# Altium project MR26_GSS.PrjPcb (part 2 of 2)

## Sheet MR26_GSS_5.SchDoc
size 385 x 297 mm; Origin: Eagle; OriginPath: C:\Users\David Nguyen\Downloads\eagle\eagle\MR26_GSS.sch; OriginSheet: 6; OriginDescription: 07 FPGA I/O, camera FPC & IR illumination
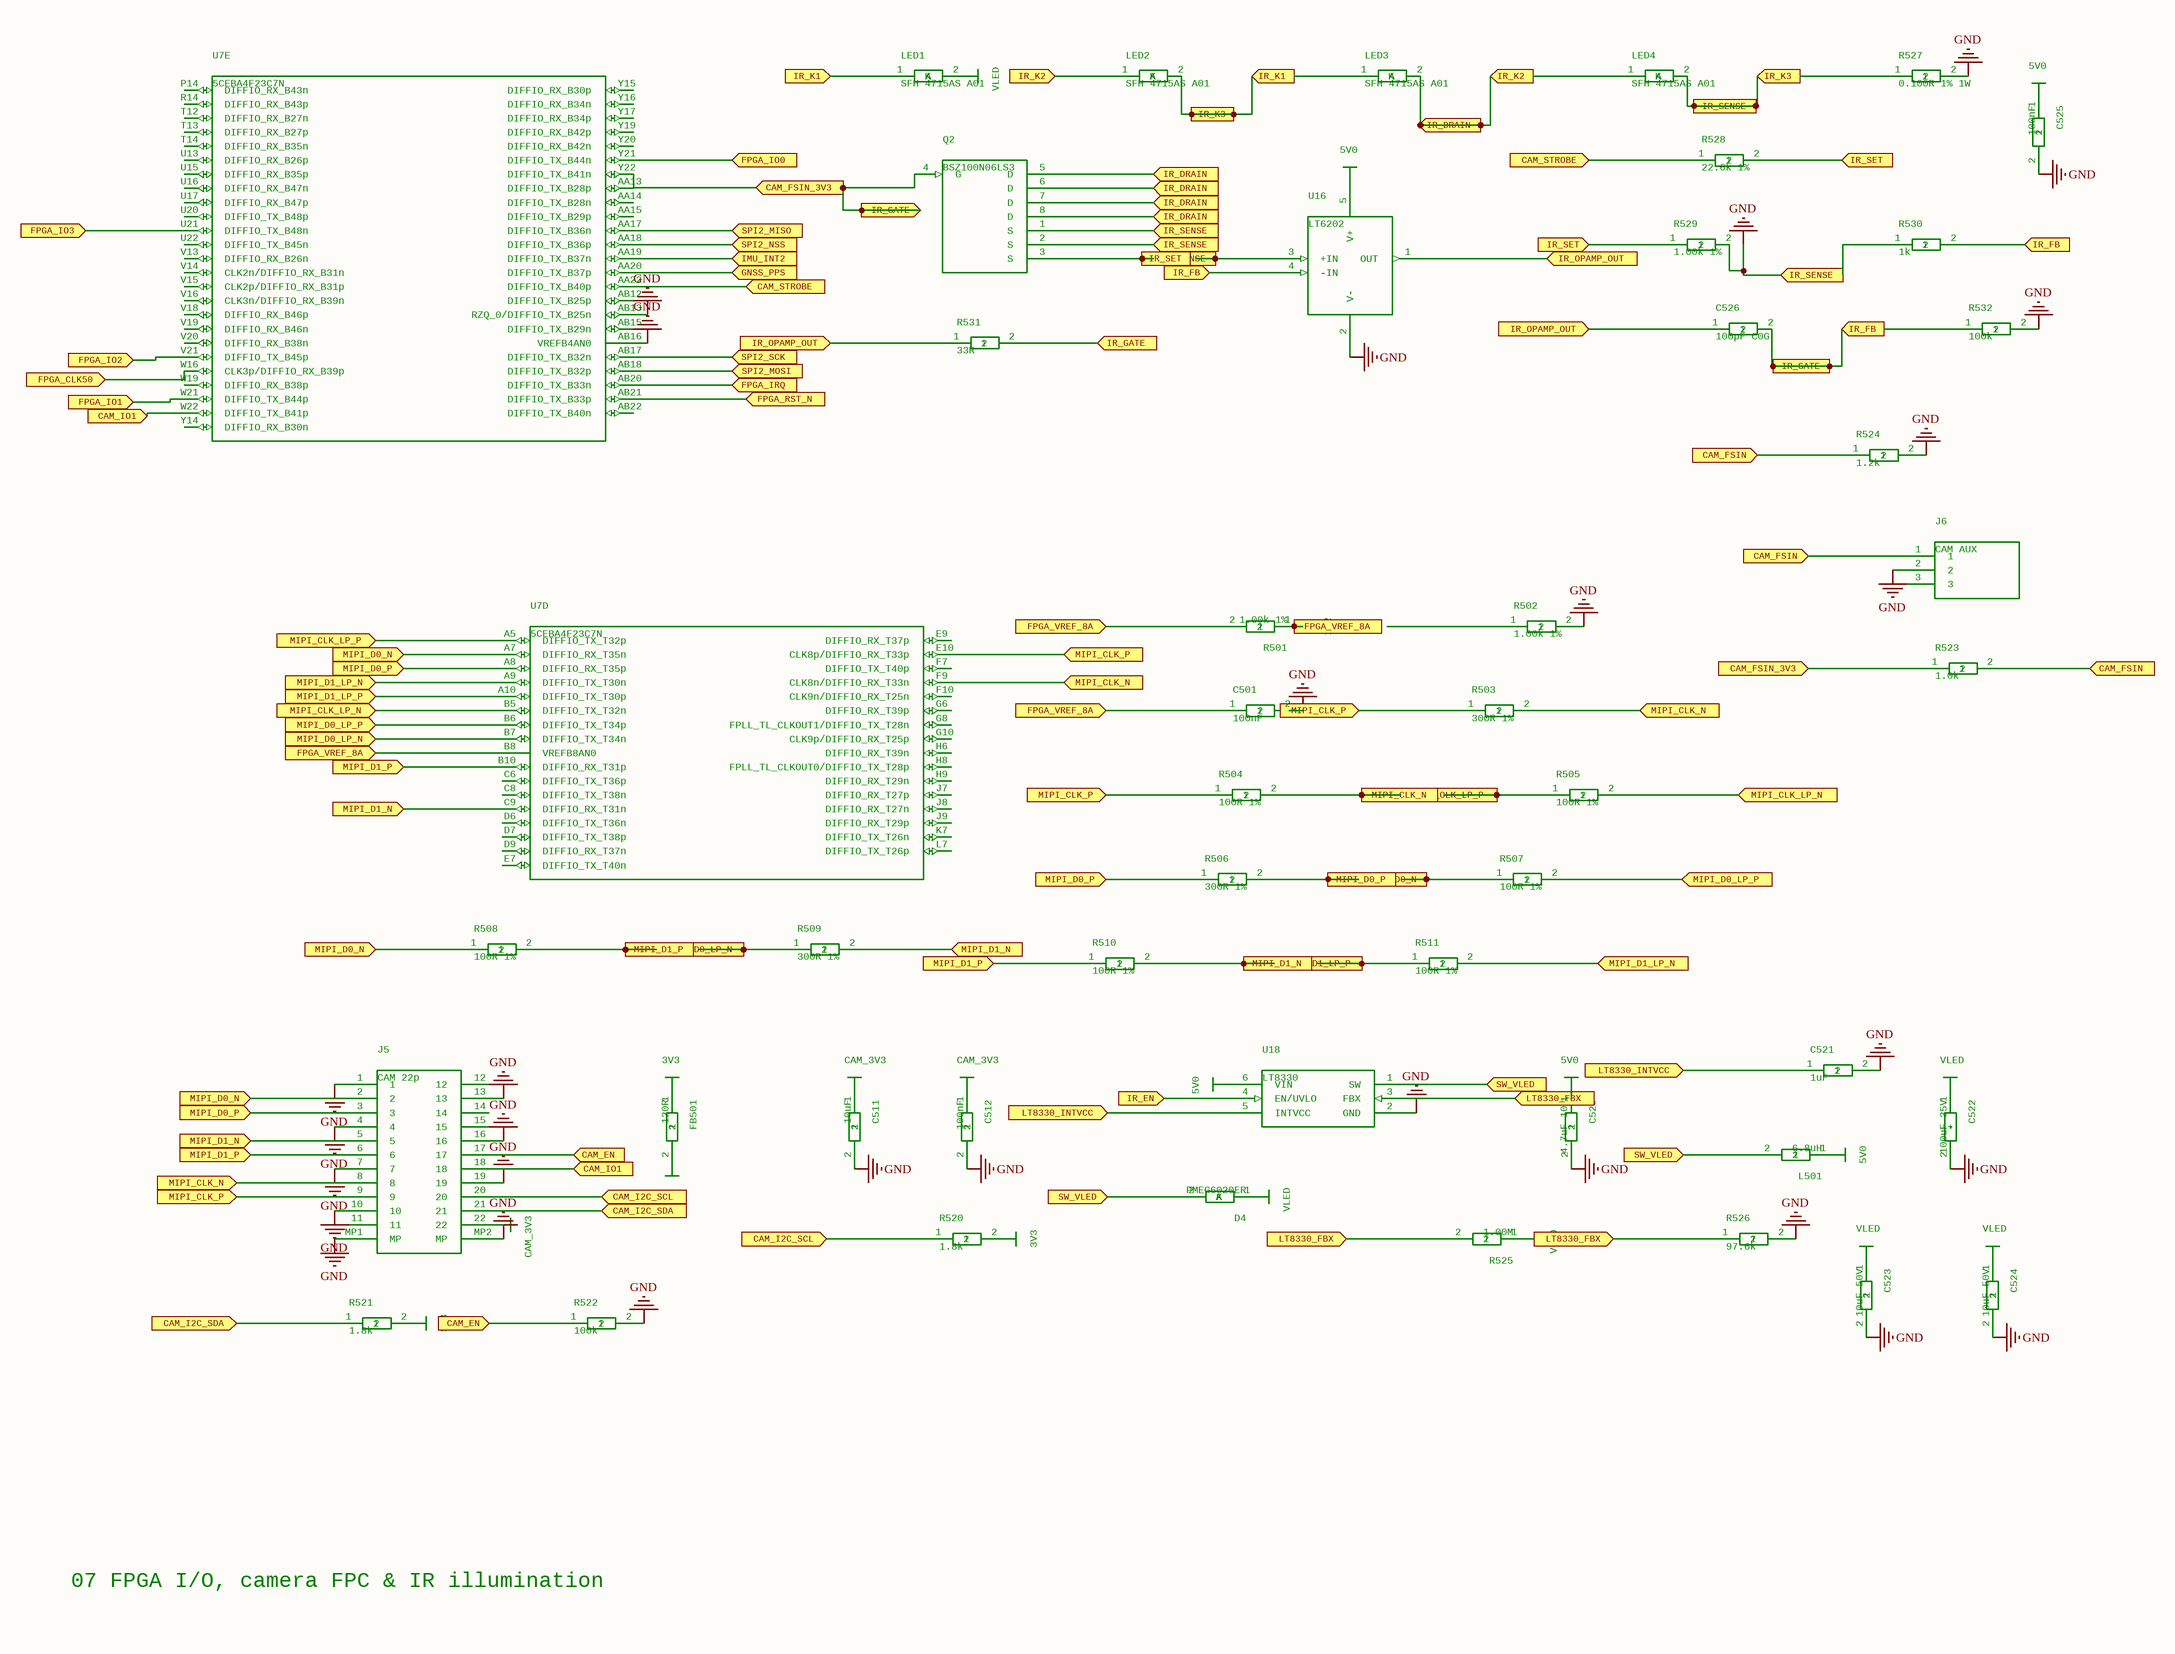
[diagram p5: MR26_GSS_5.SchDoc]

### Parts
C501  100nF  [C_0402]
C511  10uF  [C_0603]
C512  100nF  [C_0402]
C520  4.7uF 10V  [C_0603]
C521  1uF  [C_0402]
C522  100uF 35V  [C_CP_Elec_6.3x7.7]
C523  10uF 50V  [C_1210]
C524  10uF 50V  [C_1210]
C525  100nF  [C_0402]
C526  100pF C0G  [C_0402]
D4  PMEG6020ER  [D_SOD-123W]
FB501  120R  [L_0603]
J5  CAM 22p  [FH12-22S-0.5SH]
J6  CAM AUX  [PinHeader_1x03_P2.54mm]
L501  6.8uH  [L_XEL4030]
LED1  SFH 4715AS A01  [OSLON_Black_3.75x3.75]
LED2  SFH 4715AS A01  [OSLON_Black_3.75x3.75]
LED3  SFH 4715AS A01  [OSLON_Black_3.75x3.75]
LED4  SFH 4715AS A01  [OSLON_Black_3.75x3.75]
PWR0443  1V2
PWR0456  CAM_3V3
PWR0458  3V3
PWR0459  CAM_3V3
PWR0460  CAM_3V3
PWR0462  CAM_3V3
PWR0464  3V3
PWR0465  3V3
PWR0469  5V0
PWR0471  5V0
PWR0474  5V0
PWR0475  VLED
PWR0476  VLED
PWR0478  VLED
PWR0480  VLED
PWR0482  VLED
PWR0484  VLED
PWR0486  5V0
PWR0488  5V0
Q2  BSZ100N06LS3  [PG-TSDSON-8]
R501  1.00k 1%  [R_0402]
R502  1.00k 1%  [R_0402]
R503  300R 1%  [R_0402]
R504  100R 1%  [R_0402]
R505  100R 1%  [R_0402]
R506  300R 1%  [R_0402]
R507  100R 1%  [R_0402]
R508  100R 1%  [R_0402]
R509  300R 1%  [R_0402]
R510  100R 1%  [R_0402]
R511  100R 1%  [R_0402]
R520  1.8k  [R_0402]
R521  1.8k  [R_0402]
R522  100k  [R_0402]
R523  1.0k  [R_0402]
R524  1.2k  [R_0402]
R525  1.00M  [R_0402]
R526  97.6k  [R_0402]
R527  0.100R 1% 1W  [R_1206]
R528  22.6k 1%  [R_0402]
R529  1.00k 1%  [R_0402]
R530  1k  [R_0402]
R531  33R  [R_0402]
R532  100k  [R_0402]
U7  5CEBA4F23C7N  [FBGA-484_23x23_1.0mm]  (parts D,E of 12)
U16  LT6202  [TSOT-23-5]
U18  LT8330  [TSOT-23-6]

### Ports
CAM_EN (in), CAM_FSIN (in), CAM_FSIN_3V3 (in), CAM_I2C_SCL (in), CAM_I2C_SDA (in), CAM_IO1 (in), CAM_STROBE (in), FPGA_CLK50 (in), FPGA_IO0 (in), FPGA_IO1 (in), FPGA_IO2 (in), FPGA_IO3 (in), FPGA_IRQ (in), FPGA_RST_N (in), FPGA_VREF_8A (in), GNSS_PPS (in), IMU_INT2 (in), IR_DRAIN (in), IR_EN (in), IR_FB (in), IR_GATE (in), IR_K1 (in), IR_K2 (in), IR_K3 (in), IR_OPAMP_OUT (in), IR_SENSE (in), IR_SET (in), LT8330_FBX (in), LT8330_INTVCC (in), MIPI_CLK_LP_N (in), MIPI_CLK_LP_P (in), MIPI_CLK_N (in), MIPI_CLK_P (in), MIPI_D0_LP_N (in), MIPI_D0_LP_P (in), MIPI_D0_N (in), MIPI_D0_P (in), MIPI_D1_LP_N (in), MIPI_D1_LP_P (in), MIPI_D1_N (in), MIPI_D1_P (in), SPI2_MISO (in), SPI2_MOSI (in), SPI2_NSS (in), SPI2_SCK (in), SW_VLED (in)

### Nets
GND: C501.2 C511.2 C512.2 C520.2 C521.2 C522.2(-) C523.2 C524.2 C525.2 J5.1 J5.4 J5.7 J5.10 J5.13 J5.16 J5.19 J5.MP1(MP) J5.MP2(MP) J6.2 LED1.1(K) LED2.2(A) LED3.1(K) LED4.2(A) Q2.1(S) Q2.2(S) Q2.3(S) R502.2 R522.2 R524.2 R526.2 R527.1 R527.2 R528.2 R529.1 R529.2 R530.1 R532.2 U7.AB13(RZQ_0/DIFFIO_TX_B25n) U7.AB16(VREFB4AN0) U16.2(V-) U16.3(+IN) U18.2(GND) ; port IR_K1, port IR_K3, port IR_SENSE, port IR_SET
NetC501_1: C501.1 PWR0443.?1(1V2) R501.1 R501.2 U7.B8(VREFB8AN0) ; port FPGA_VREF_8A
NetC511_1: C511.1 PWR0460.?1(CAM_3V3)
NetC512_1: C512.1 PWR0462.?1(CAM_3V3)
NetC520_1: C520.1 PWR0471.?1(5V0)
NetC521_1: C521.1 U18.5(INTVCC) ; port LT8330_INTVCC
NetC522_1: C522.1(+) PWR0478.?1(VLED)
NetC523_1: C523.1 PWR0480.?1(VLED)
NetC524_1: C524.1 PWR0482.?1(VLED)
NetC525_1: C525.1 PWR0488.?1(5V0)
NetC526_1: C526.1 R531.1 U16.1(OUT) ; port IR_OPAMP_OUT
NetC526_2: C526.2 Q2.4(G) R523.1 R530.2 R531.2 R532.1 U7.Y22(DIFFIO_TX_B41n) U16.4(-IN) ; port CAM_FSIN_3V3, port IR_GATE, port IR_FB
NetD4_1: D4.1(K) PWR0475.?1(VLED)
NetD4_2: D4.2(A) L501.2 U18.1(SW) ; port SW_VLED
NetFB501_1: FB501.1 PWR0458.?1(3V3)
NetFB501_2: FB501.2 PWR0459.?1(CAM_3V3)
NetJ5_2: J5.2 J5.3 R506.1 R506.2 R507.1 R508.1 U7.A7(DIFFIO_RX_T35n) U7.A8(DIFFIO_RX_T35p) ; port MIPI_D0_N, port MIPI_D0_P
NetJ5_5: J5.5 R509.2 R510.2 R511.1 U7.A10(DIFFIO_TX_T30p) U7.C9(DIFFIO_RX_T31n) ; port MIPI_D1_LP_P, port MIPI_D1_N
NetJ5_6: J5.6 R508.2 R509.1 R510.1 U7.B7(DIFFIO_TX_T34n) U7.B10(DIFFIO_RX_T31p) ; port MIPI_D0_LP_N, port MIPI_D1_P
NetJ5_8: J5.8 R503.2 R504.2 R505.1 U7.A5(DIFFIO_TX_T32p) U7.F9(CLK8n/DIFFIO_RX_T33n) ; port MIPI_CLK_LP_P, port MIPI_CLK_N
NetJ5_9: J5.9 R503.1 R504.1 U7.E10(CLK8p/DIFFIO_RX_T33p) ; port MIPI_CLK_P
NetJ5_17: J5.17 R522.1 ; port CAM_EN
NetJ5_18: J5.18 U7.W22(DIFFIO_TX_B41p) ; port CAM_IO1
NetJ5_20: J5.20 R520.1 ; port CAM_I2C_SCL
NetJ5_21: J5.21 R521.1 ; port CAM_I2C_SDA
NetJ5_22: J5.22 PWR0456.?1(CAM_3V3)
NetJ6_1: J6.1 R523.2 R524.1 ; port CAM_FSIN
NetJ9_2: U7.Y21(DIFFIO_TX_B44n) ; port FPGA_IO0
NetJ9_3: U7.W21(DIFFIO_TX_B44p) ; port FPGA_IO1
NetJ9_4: U7.V21(DIFFIO_TX_B45p) ; port FPGA_IO2
NetJ9_5: U7.U21(DIFFIO_TX_B48n) ; port FPGA_IO3
NetL501_1: L501.1 PWR0474.?1(5V0)
NetLED1_2: LED1.2(A) PWR0484.?1(VLED)
NetLED2_1: LED2.1(K) LED3.2(A) LED4.1(K) Q2.5(D) Q2.6(D) Q2.7(D) Q2.8(D) ; port IR_K2, port IR_DRAIN
NetPWR0464_?1: PWR0464.?1(3V3) R520.2
NetPWR0465_?1: PWR0465.?1(3V3) R521.2
NetPWR0469_?1: PWR0469.?1(5V0) U18.6(VIN)
NetPWR0476_?1: PWR0476.?1(VLED) R525.1
NetPWR0486_?1: PWR0486.?1(5V0) U16.5(V+)
NetR305_1: U7.AB20(DIFFIO_TX_B33n) ; port FPGA_IRQ
NetR306_1: U18.4(EN/UVLO) ; port IR_EN
NetR420_2: U7.W16(CLK3p/DIFFIO_RX_B39p) ; port FPGA_CLK50
NetR505_2: R505.2 U7.B5(DIFFIO_TX_T32n) ; port MIPI_CLK_LP_N
NetR507_2: R507.2 U7.B6(DIFFIO_TX_T34p) ; port MIPI_D0_LP_P
NetR511_2: R511.2 U7.A9(DIFFIO_TX_T30n) ; port MIPI_D1_LP_N
NetR525_2: R525.2 R526.1 U18.3(FBX) ; port LT8330_FBX
NetR528_1: R528.1 U7.AA22(DIFFIO_TX_B40p) ; port CAM_STROBE
NetU6_12: U7.AA20(DIFFIO_TX_B37p) ; port GNSS_PPS
NetU6_23: U7.AA19(DIFFIO_TX_B37n) ; port IMU_INT2
NetU6_34: U7.AA18(DIFFIO_TX_B36p) ; port SPI2_NSS
NetU6_35: U7.AB17(DIFFIO_TX_B32n) ; port SPI2_SCK
NetU6_36: U7.AA17(DIFFIO_TX_B36n) ; port SPI2_MISO
NetU6_37: U7.AB18(DIFFIO_TX_B32p) ; port SPI2_MOSI
NetU6_39: U7.AB21(DIFFIO_TX_B33p) ; port FPGA_RST_N

Not connected (* = marked no-connect by the designer): J5 11 12 14 15; J6 3; R502 1; U7 AA13(DIFFIO_TX_B28p) AA14(DIFFIO_TX_B28n) AA15(DIFFIO_TX_B29p) AB12(DIFFIO_TX_B25p) AB15(DIFFIO_TX_B29n) AB22(DIFFIO_TX_B40n) C6(DIFFIO_TX_T36p) C8(DIFFIO_TX_T38n) D6(DIFFIO_TX_T36n) D7(DIFFIO_TX_T38p) D9(DIFFIO_RX_T37n) E7(DIFFIO_TX_T40n) E9(DIFFIO_RX_T37p) F7(DIFFIO_TX_T40p) F10(CLK9n/DIFFIO_RX_T25n) G6(DIFFIO_RX_T39p) G8(FPLL_TL_CLKOUT1/DIFFIO_TX_T28n) G10(CLK9p/DIFFIO_RX_T25p) H6(DIFFIO_RX_T39n) H8(FPLL_TL_CLKOUT0/DIFFIO_TX_T28p) H9(DIFFIO_RX_T29n) J7(DIFFIO_RX_T27p) J8(DIFFIO_RX_T27n) J9(DIFFIO_RX_T29p) K7(DIFFIO_TX_T26n) L7(DIFFIO_TX_T26p) P14(DIFFIO_RX_B43n) R14(DIFFIO_RX_B43p) T12(DIFFIO_RX_B27n) T13(DIFFIO_RX_B27p) T14(DIFFIO_RX_B35n) U13(DIFFIO_RX_B26p) U15(DIFFIO_RX_B35p) U16(DIFFIO_RX_B47n) U17(DIFFIO_RX_B47p) U20(DIFFIO_TX_B48p) U22(DIFFIO_TX_B45n) V13(DIFFIO_RX_B26n) V14(CLK2n/DIFFIO_RX_B31n) V15(CLK2p/DIFFIO_RX_B31p) V16(CLK3n/DIFFIO_RX_B39n) V18(DIFFIO_RX_B46p) V19(DIFFIO_RX_B46n) V20(DIFFIO_RX_B38n) W19(DIFFIO_RX_B38p) Y14(DIFFIO_RX_B30n) Y15(DIFFIO_RX_B30p) Y16(DIFFIO_RX_B34n) Y17(DIFFIO_RX_B34p) Y19(DIFFIO_RX_B42p) Y20(DIFFIO_RX_B42n)

### Notes on the sheet
- 07 FPGA I/O, camera FPC & IR illumination

### Library data of the parts
C501 C512 C525 = CAPC_0402: as C221 on sheet MR26_GSS_1; DeviceName: C_0402; LibraryName: MR26; DeviceSetName: CAP
C511 = CAPC_0603: as C455 on sheet MR26_GSS_3; DeviceName: C_0603; LibraryName: MR26; DeviceSetName: CAP
C520 = CAPC_0603: MPN: CAP 4.7uF 10V 0603; GateName_1: G$1; SymbolName_1: CAP; DeviceName: C_0603; LibraryName: MR26; DeviceSetName: CAP
C521 = CAPC_0402: MPN: CAP 1uF 0402; GateName_1: G$1; SymbolName_1: CAP; DeviceName: C_0402; LibraryName: MR26; DeviceSetName: CAP
C522 = CAP_POLC_CP_Elec_6.3x7.7: MPN: Panasonic EEH-ZA1V101P; GateName_1: G$1; SymbolName_1: CAP_POL; DeviceName: C_CP_Elec_6.3x7.7; LibraryName: MR26; DeviceSetName: CAP_POL
C523 C524 = CAPC_1210: MPN: CAP 10uF 50V 1210; GateName_1: G$1; SymbolName_1: CAP; DeviceName: C_1210; LibraryName: MR26; DeviceSetName: CAP
C526 = CAPC_0402: MPN: CAP 100pF C0G 0402; GateName_1: G$1; SymbolName_1: CAP; DeviceName: C_0402; LibraryName: MR26; DeviceSetName: CAP
D4 = DIODE_SCHOTTKYD_SOD-123W: GateName_1: G$1; SymbolName_1: DIODE_SCHOTTKY; DeviceName: D_SOD-123W; LibraryName: MR26; DeviceSetName: DIODE_SCHOTTKY; MPN: PMEG6020ER
FB501 = FERRITEL_0603: MPN: Murata BLM18PG121SN1D; GateName_1: G$1; SymbolName_1: FERRITE; DeviceName: L_0603; LibraryName: MR26; DeviceSetName: FERRITE
J5 = FH12_22SFH12-22S-0.5SH: MPN: Hirose FH12-22S-0.5SH(55); GateName_1: G$1; SymbolName_1: FH12_22S; DeviceName: FH12-22S-0.5SH; LibraryName: MR26; DeviceSetName: FH12_22S
J6 = HDR_1X3PinHeader_1x03_P2.54mm: MPN: Wurth 61300311121; GateName_1: G$1; SymbolName_1: HDR_1X3; DeviceName: PinHeader_1x03_P2.54mm; LibraryName: MR26; DeviceSetName: HDR_1X3
L501 = INDL_XEL4030: MPN: Coilcraft XEL4030-682MEC; GateName_1: G$1; SymbolName_1: IND; DeviceName: L_XEL4030; LibraryName: MR26; DeviceSetName: IND
LED1-LED4 = LEDOSLON_Black_3.75x3.75: MPN: ams OSRAM SFH 4715AS A01 (Q65112A3325); GateName_1: G$1; SymbolName_1: LED; DeviceName: OSLON_Black_3.75x3.75; LibraryName: MR26; DeviceSetName: LED
PWR0443 = PWR_1V2: GateName_1: G$1; SymbolName_1: PWR_1V2; LibraryName: MR26; DeviceSetName: PWR_1V2
PWR0456 PWR0459 PWR0460 PWR0462 = PWR_CAM_3V3: GateName_1: G$1; SymbolName_1: PWR_CAM_3V3; LibraryName: MR26; DeviceSetName: PWR_CAM_3V3
PWR0458 PWR0464 PWR0465 = PWR_3V3: GateName_1: G$1; SymbolName_1: PWR_3V3; LibraryName: MR26; DeviceSetName: PWR_3V3
PWR0469 PWR0471 PWR0474 PWR0486 PWR0488 = PWR_5V0: GateName_1: G$1; SymbolName_1: PWR_5V0; LibraryName: MR26; DeviceSetName: PWR_5V0
PWR0475 PWR0476 PWR0478 PWR0480 PWR0482 PWR0484 = PWR_VLED: GateName_1: G$1; SymbolName_1: PWR_VLED; LibraryName: MR26; DeviceSetName: PWR_VLED
Q2 = NMOS_SUPERSO8PG-TSDSON-8: MPN: BSZ100N06LS3 G; GateName_1: G$1; SymbolName_1: NMOS_SUPERSO8; DeviceName: PG-TSDSON-8; LibraryName: MR26; DeviceSetName: NMOS_SUPERSO8
R501 R502 R529 = RESR_0402: MPN: RES 1.00k 1% 0402; GateName_1: G$1; SymbolName_1: RES; DeviceName: R_0402; LibraryName: MR26; DeviceSetName: RES
R503 R506 R509 = RESR_0402: MPN: RES 300R 1% 0402; GateName_1: G$1; SymbolName_1: RES; DeviceName: R_0402; LibraryName: MR26; DeviceSetName: RES
R504 R505 R507 R508 R510 R511 = RESR_0402: MPN: RES 100R 1% 0402; GateName_1: G$1; SymbolName_1: RES; DeviceName: R_0402; LibraryName: MR26; DeviceSetName: RES
R520 R521 = RESR_0402: MPN: RES 1.8k 0402; GateName_1: G$1; SymbolName_1: RES; DeviceName: R_0402; LibraryName: MR26; DeviceSetName: RES
R522 R532 = RESR_0402: as R201 on sheet MR26_GSS_0; DeviceName: R_0402; LibraryName: MR26; DeviceSetName: RES
R523 = RESR_0402: MPN: RES 1.0k 0402; GateName_1: G$1; SymbolName_1: RES; DeviceName: R_0402; LibraryName: MR26; DeviceSetName: RES
R524 = RESR_0402: MPN: RES 1.2k 0402; GateName_1: G$1; SymbolName_1: RES; DeviceName: R_0402; LibraryName: MR26; DeviceSetName: RES
R525 = RESR_0402: MPN: RES 1.00M 0402; GateName_1: G$1; SymbolName_1: RES; DeviceName: R_0402; LibraryName: MR26; DeviceSetName: RES
R526 = RESR_0402: MPN: RES 97.6k 0402; GateName_1: G$1; SymbolName_1: RES; DeviceName: R_0402; LibraryName: MR26; DeviceSetName: RES
R527 = RESR_1206: MPN: RES 0.100R 1% 1W 1206; GateName_1: G$1; SymbolName_1: RES; DeviceName: R_1206; LibraryName: MR26; DeviceSetName: RES
R528 = RESR_0402: MPN: RES 22.6k 1% 0402; GateName_1: G$1; SymbolName_1: RES; DeviceName: R_0402; LibraryName: MR26; DeviceSetName: RES
R530 = RESR_0402: MPN: RES 1k 0402; GateName_1: G$1; SymbolName_1: RES; DeviceName: R_0402; LibraryName: MR26; DeviceSetName: RES
R531 = RESR_0402: MPN: RES 33R 0402; GateName_1: G$1; SymbolName_1: RES; DeviceName: R_0402; LibraryName: MR26; DeviceSetName: RES
U7 = 5CEBA4F23C7NFBGA-484_23x23_1.0mm: as U7 on sheet MR26_GSS_3; DeviceName: FBGA-484_23x23_1.0mm; LibraryName: MR26; DeviceSetName: 5CEBA4F23C7N; MPN: 5CEBA4F23C7N
U16 = LT6202_TSOT5TSOT-23-5: MPN: LT6202HS5#TRPBF; GateName_1: G$1; SymbolName_1: LT6202_TSOT5; DeviceName: TSOT-23-5; LibraryName: MR26; DeviceSetName: LT6202_TSOT5
U18 = LT8330_TSOT6TSOT-23-6: MPN: LT8330ES6#TRMPBF; GateName_1: G$1; SymbolName_1: LT8330_TSOT6; DeviceName: TSOT-23-6; LibraryName: MR26; DeviceSetName: LT8330_TSOT6

## Sheet MR26_GSS_6.SchDoc
size 373 x 296 mm; Origin: Eagle; OriginPath: C:\Users\David Nguyen\Downloads\eagle\eagle\MR26_GSS.sch; OriginSheet: 7; OriginDescription: 08 Sensors: IMU, 3x ToF, GNSS
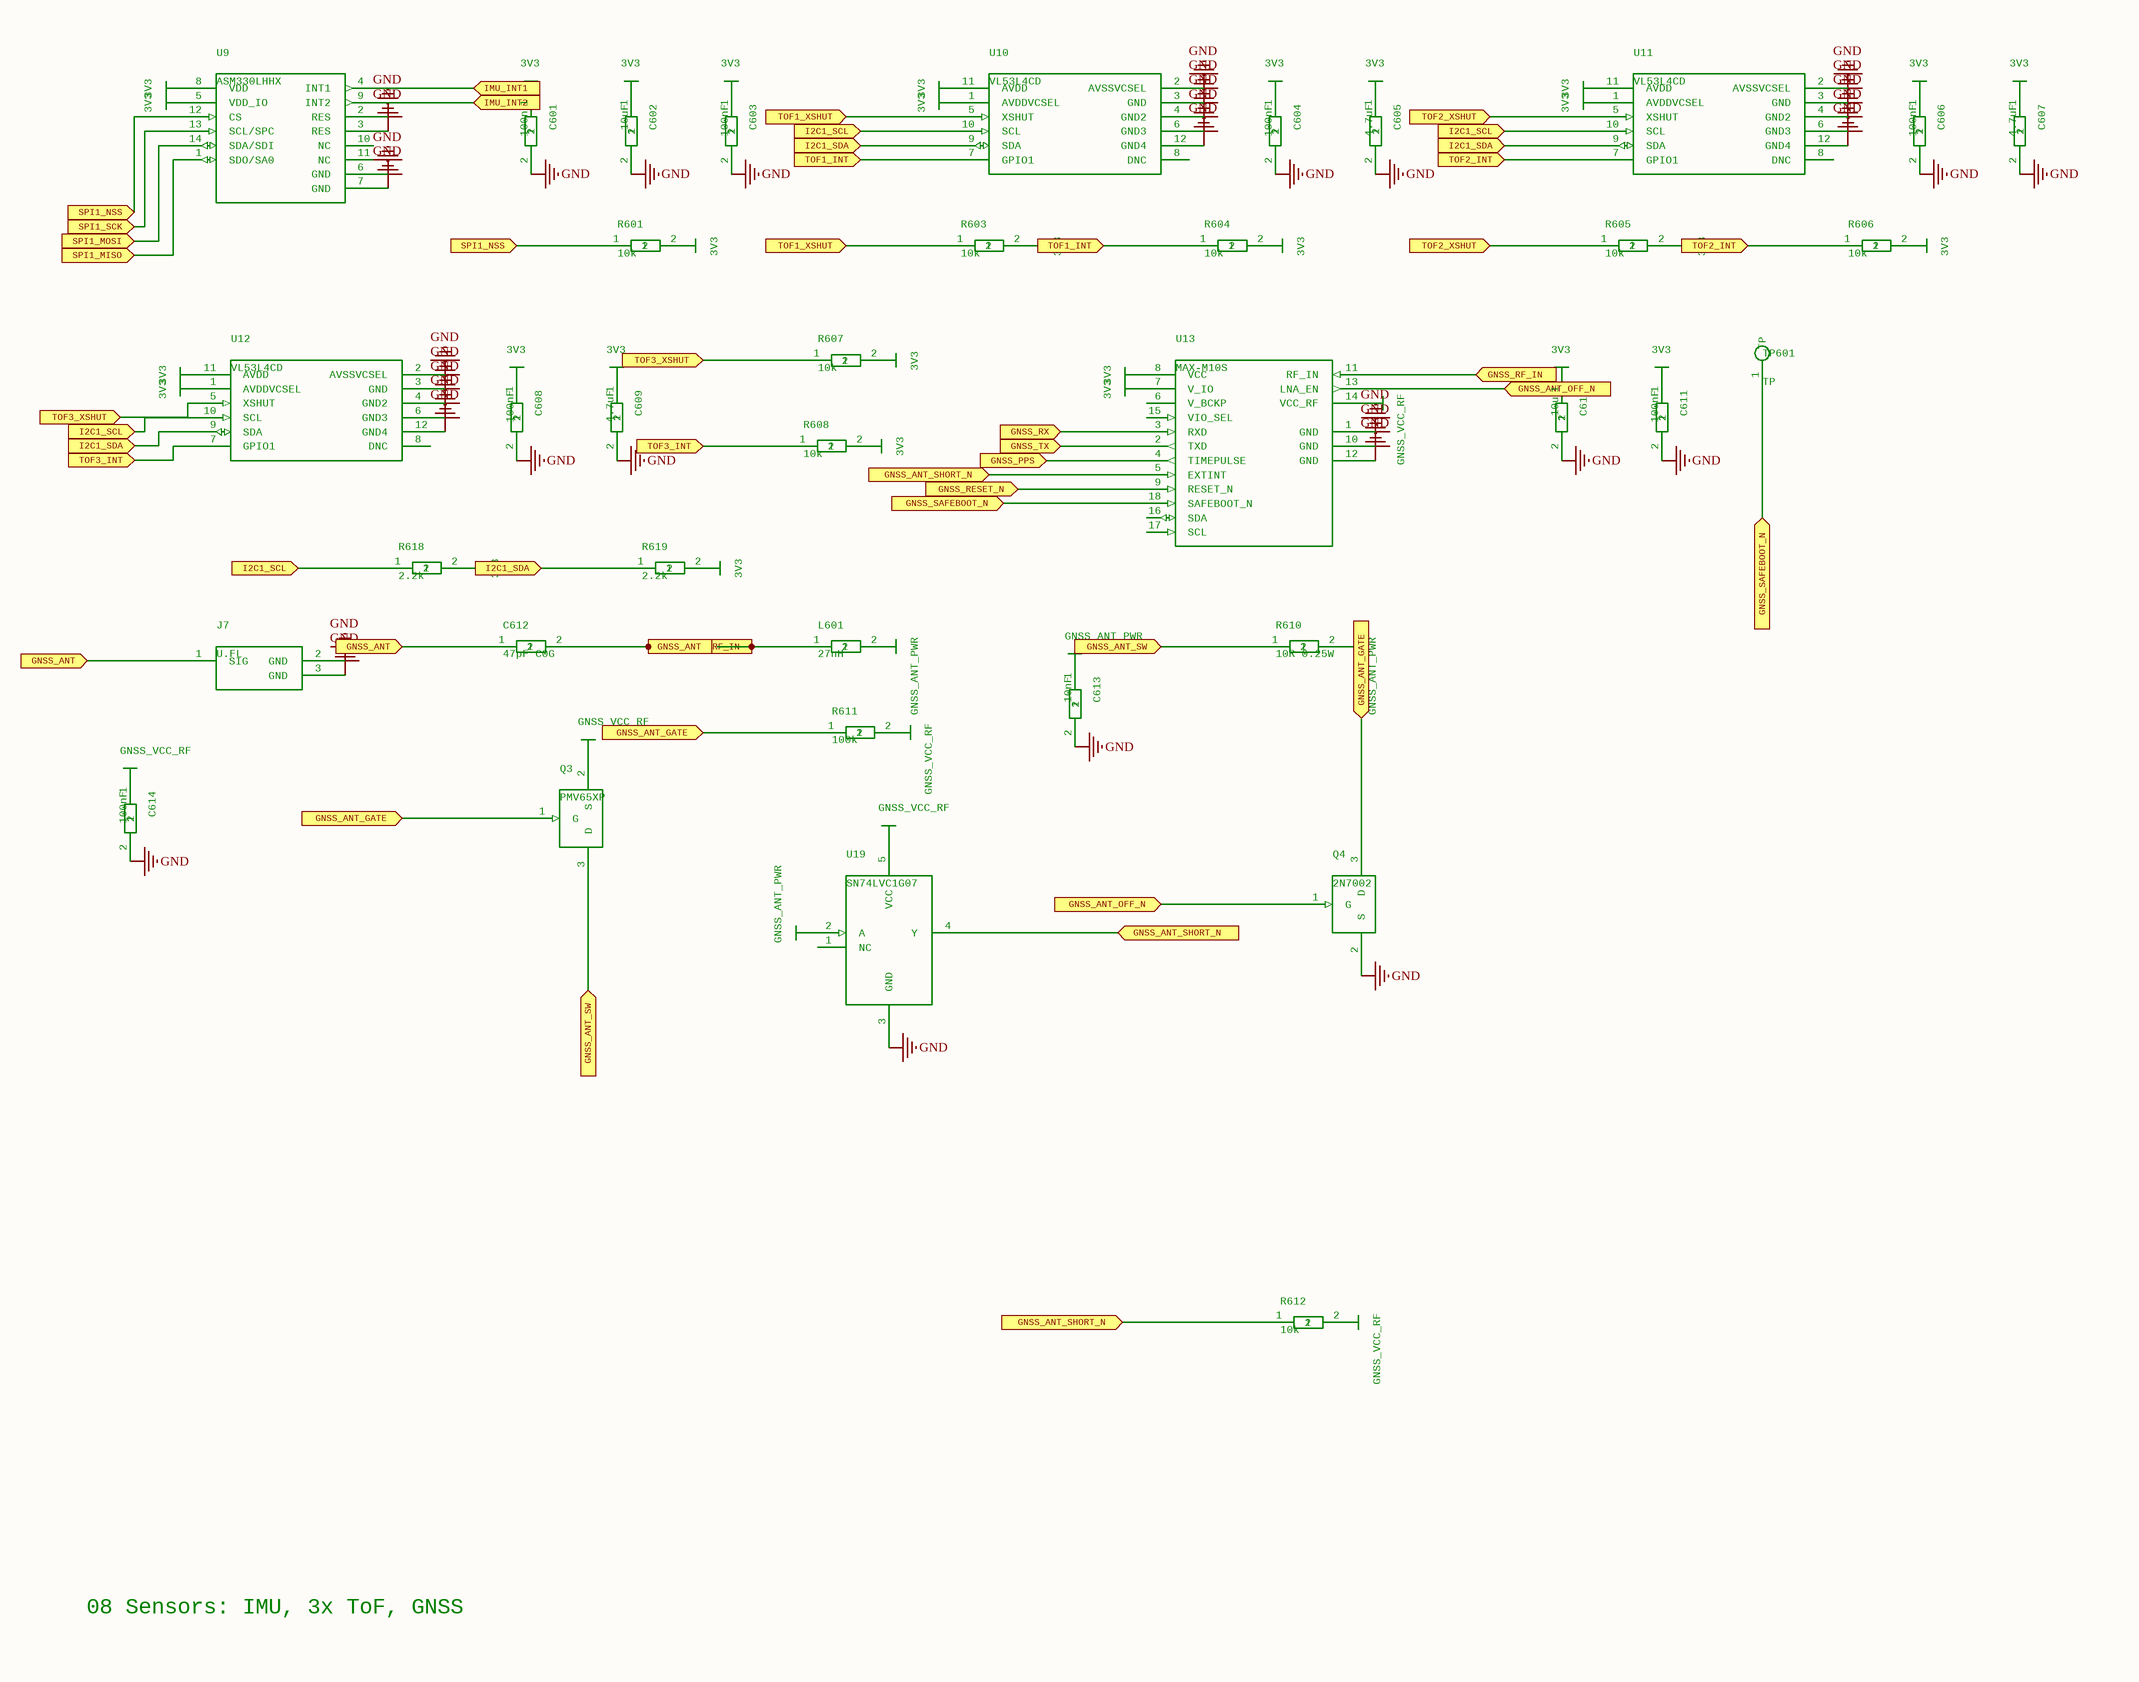
[diagram p6: MR26_GSS_6.SchDoc]

### Parts
C601  100nF  [C_0402]
C602  10uF  [C_0603]
C603  100nF  [C_0402]
C604  100nF  [C_0402]
C605  4.7uF  [C_0603]
C606  100nF  [C_0402]
C607  4.7uF  [C_0603]
C608  100nF  [C_0402]
C609  4.7uF  [C_0603]
C610  10uF  [C_0603]
C611  100nF  [C_0402]
C612  47pF C0G  [C_0402]
C613  10nF  [C_0402]
C614  100nF  [C_0402]
J7  U.FL  [U.FL_Hirose]
L601  27nH  [L_0402]
PWR0492  3V3
PWR0493  3V3
PWR0498  3V3
PWR0500  3V3
PWR0502  3V3
PWR0504  3V3
PWR0505  3V3
PWR0506  3V3
PWR0512  3V3
PWR0514  3V3
PWR0516  3V3
PWR0517  3V3
PWR0518  3V3
PWR0519  3V3
PWR0525  3V3
PWR0527  3V3
PWR0529  3V3
PWR0530  3V3
PWR0531  3V3
PWR0532  3V3
PWR0538  3V3
PWR0540  3V3
PWR0542  3V3
PWR0543  3V3
PWR0544  3V3
PWR0545  3V3
PWR0546  3V3
PWR0547  3V3
PWR0548  GNSS_VCC_RF
PWR0552  3V3
PWR0554  3V3
PWR0558  GNSS_ANT_PWR
PWR0559  GNSS_ANT_PWR
PWR0561  GNSS_ANT_PWR
PWR0562  GNSS_VCC_RF
PWR0563  GNSS_VCC_RF
PWR0565  GNSS_ANT_PWR
PWR0566  GNSS_VCC_RF
PWR0568  GNSS_VCC_RF
PWR0570  GNSS_VCC_RF
Q3  PMV65XP  [SOT-23]
Q4  2N7002  [SOT-23]
R601  10k  [R_0402]
R603  10k  [R_0402]
R604  10k  [R_0402]
R605  10k  [R_0402]
R606  10k  [R_0402]
R607  10k  [R_0402]
R608  10k  [R_0402]
R610  10R 0.25W  [R_0603]
R611  100k  [R_0402]
R612  10k  [R_0402]
R618  2.2k  [R_0402]
R619  2.2k  [R_0402]
TP601  TP  [TP_1.0mm]
U9  ASM330LHHX  [LGA-14L_2.5x3]
U10  VL53L4CD  [VL53L4CD_LGA12]
U11  VL53L4CD  [VL53L4CD_LGA12]
U12  VL53L4CD  [VL53L4CD_LGA12]
U13  MAX-M10S  [u-blox_LCC-18_9.7x10.1]
U19  SN74LVC1G07  [SOT-23-5]

### Ports
GNSS_ANT (in), GNSS_ANT_GATE (in), GNSS_ANT_OFF_N (in), GNSS_ANT_SHORT_N (in), GNSS_ANT_SW (in), GNSS_PPS (in), GNSS_RESET_N (in), GNSS_RF_IN (in), GNSS_RX (in), GNSS_SAFEBOOT_N (in), GNSS_TX (in), I2C1_SCL (in), I2C1_SDA (in), IMU_INT1 (in), IMU_INT2 (in), SPI1_MISO (in), SPI1_MOSI (in), SPI1_NSS (in), SPI1_SCK (in), TOF1_INT (in), TOF1_XSHUT (in), TOF2_INT (in), TOF2_XSHUT (in), TOF3_INT (in), TOF3_XSHUT (in)

### Nets
GND: C601.2 C602.2 C603.2 C604.2 C605.2 C606.2 C607.2 C608.2 C609.2 C610.2 C611.2 C613.2 C614.2 J7.2(GND) J7.3(GND) Q4.2(S) U9.2(RES) U9.3(RES) U9.6(GND) U9.7(GND) U10.2(AVSSVCSEL) U10.3(GND) U10.4(GND2) U10.6(GND3) U10.12(GND4) U11.2(AVSSVCSEL) U11.3(GND) U11.4(GND2) U11.6(GND3) U11.12(GND4) U12.2(AVSSVCSEL) U12.3(GND) U12.4(GND2) U12.6(GND3) U12.12(GND4) U13.1(GND) U13.10(GND) U13.12(GND) U19.3(GND)
NetC601_1: C601.1 PWR0498.?1(3V3)
NetC602_1: C602.1 PWR0500.?1(3V3)
NetC603_1: C603.1 PWR0502.?1(3V3)
NetC604_1: C604.1 PWR0512.?1(3V3)
NetC605_1: C605.1 PWR0514.?1(3V3)
NetC606_1: C606.1 PWR0525.?1(3V3)
NetC607_1: C607.1 PWR0527.?1(3V3)
NetC608_1: C608.1 PWR0538.?1(3V3)
NetC609_1: C609.1 PWR0540.?1(3V3)
NetC610_1: C610.1 PWR0552.?1(3V3)
NetC611_1: C611.1 PWR0554.?1(3V3)
NetC612_1: C612.1 C612.2 J7.1(SIG) L601.1 U13.11(RF_IN) ; port GNSS_RF_IN, port GNSS_ANT
NetC613_1: C613.1 PWR0559.?1(GNSS_ANT_PWR)
NetC614_1: C614.1 PWR0568.?1(GNSS_VCC_RF)
NetL601_2: L601.2 PWR0558.?1(GNSS_ANT_PWR)
NetPWR0492_?1: PWR0492.?1(3V3) U9.8(VDD)
NetPWR0493_?1: PWR0493.?1(3V3) U9.5(VDD_IO)
NetPWR0504_?1: PWR0504.?1(3V3) R601.2
NetPWR0505_?1: PWR0505.?1(3V3) U10.11(AVDD)
NetPWR0506_?1: PWR0506.?1(3V3) U10.1(AVDDVCSEL)
NetPWR0516_?1: PWR0516.?1(3V3) R603.2
NetPWR0517_?1: PWR0517.?1(3V3) R604.2
NetPWR0518_?1: PWR0518.?1(3V3) U11.11(AVDD)
NetPWR0519_?1: PWR0519.?1(3V3) U11.1(AVDDVCSEL)
NetPWR0529_?1: PWR0529.?1(3V3) R605.2
NetPWR0530_?1: PWR0530.?1(3V3) R606.2
NetPWR0531_?1: PWR0531.?1(3V3) U12.11(AVDD)
NetPWR0532_?1: PWR0532.?1(3V3) U12.1(AVDDVCSEL)
NetPWR0542_?1: PWR0542.?1(3V3) R607.2
NetPWR0543_?1: PWR0543.?1(3V3) R608.2
NetPWR0544_?1: PWR0544.?1(3V3) R618.2
NetPWR0545_?1: PWR0545.?1(3V3) R619.2
NetPWR0546_?1: PWR0546.?1(3V3) U13.8(VCC)
NetPWR0547_?1: PWR0547.?1(3V3) U13.7(V_IO)
NetPWR0548_?1: PWR0548.?1(GNSS_VCC_RF) U13.14(VCC_RF)
NetPWR0561_?1: PWR0561.?1(GNSS_ANT_PWR) R610.2
NetPWR0562_?1: PWR0562.?1(GNSS_VCC_RF) Q3.2(S)
NetPWR0563_?1: PWR0563.?1(GNSS_VCC_RF) R611.2
NetPWR0565_?1: PWR0565.?1(GNSS_ANT_PWR) U19.2(A)
NetPWR0566_?1: PWR0566.?1(GNSS_VCC_RF) U19.5(VCC)
NetPWR0570_?1: PWR0570.?1(GNSS_VCC_RF) R612.2
NetQ3_1: Q3.1(G) Q4.3(D) R611.1 ; port GNSS_ANT_GATE
NetQ3_3: Q3.3(D) R610.1 ; port GNSS_ANT_SW
NetQ4_1: Q4.1(G) U13.13(LNA_EN) ; port GNSS_ANT_OFF_N
NetR601_1: R601.1 U9.12(CS) ; port SPI1_NSS
NetR603_1: R603.1 U10.5(XSHUT) ; port TOF1_XSHUT
NetR604_1: R604.1 U10.7(GPIO1) ; port TOF1_INT
NetR605_1: R605.1 U11.5(XSHUT) ; port TOF2_XSHUT
NetR606_1: R606.1 U11.7(GPIO1) ; port TOF2_INT
NetR607_1: R607.1 R618.1 U10.10(SCL) U11.10(SCL) U12.5(XSHUT) U12.10(SCL) ; port I2C1_SCL, port TOF3_XSHUT
NetR608_1: R608.1 U12.7(GPIO1) ; port TOF3_INT
NetR612_1: R612.1 U13.5(EXTINT) U19.4(Y) ; port GNSS_ANT_SHORT_N
NetR619_1: R619.1 U10.9(SDA) U11.9(SDA) U12.9(SDA) ; port I2C1_SDA
NetTP601_1: TP601.1(TP) U13.18(SAFEBOOT_N) ; port GNSS_SAFEBOOT_N
NetU6_12: U13.4(TIMEPULSE) ; port GNSS_PPS
NetU6_14: U13.3(RXD) ; port GNSS_RX
NetU6_17: U13.2(TXD) ; port GNSS_TX
NetU6_19: U9.13(SCL/SPC) ; port SPI1_SCK
NetU6_20: U9.1(SDO/SA0) ; port SPI1_MISO
NetU6_21: U9.14(SDA/SDI) ; port SPI1_MOSI
NetU6_22: U9.4(INT1) ; port IMU_INT1
NetU6_23: U9.9(INT2) ; port IMU_INT2
NetU6_30: U13.9(RESET_N) ; port GNSS_RESET_N

Not connected (* = marked no-connect by the designer): U9 10(NC) 11(NC); U10 8(DNC); U11 8(DNC); U12 8(DNC); U13 6(V_BCKP) 15(VIO_SEL) 16(SDA) 17(SCL); U19 1(NC)

### Notes on the sheet
- 08 Sensors: IMU, 3x ToF, GNSS

### Library data of the parts
C601 C603 C604 C606 C608 C611 C614 = CAPC_0402: MPN: CAP 100nF 0402; GateName_1: G$1; SymbolName_1: CAP; DeviceName: C_0402; LibraryName: MR26; DeviceSetName: CAP
C602 C610 = CAPC_0603: MPN: CAP 10uF 0603; GateName_1: G$1; SymbolName_1: CAP; DeviceName: C_0603; LibraryName: MR26; DeviceSetName: CAP
C605 C607 C609 = CAPC_0603: MPN: CAP 4.7uF 0603; GateName_1: G$1; SymbolName_1: CAP; DeviceName: C_0603; LibraryName: MR26; DeviceSetName: CAP
C612 = CAPC_0402: MPN: CAP 47pF C0G 0402; GateName_1: G$1; SymbolName_1: CAP; DeviceName: C_0402; LibraryName: MR26; DeviceSetName: CAP
C613 = CAPC_0402: MPN: CAP 10nF 0402; GateName_1: G$1; SymbolName_1: CAP; DeviceName: C_0402; LibraryName: MR26; DeviceSetName: CAP
J7 = UFLU.FL_Hirose: MPN: Hirose U.FL-R-SMT-1(10); GateName_1: G$1; SymbolName_1: UFL; DeviceName: U.FL_Hirose; LibraryName: MR26; DeviceSetName: UFL
L601 = INDL_0402: MPN: Murata LQG15HS27NJ02D; GateName_1: G$1; SymbolName_1: IND; DeviceName: L_0402; LibraryName: MR26; DeviceSetName: IND
PWR0492 PWR0493 PWR0498 PWR0500 PWR0502 PWR0504 PWR0505 PWR0506 PWR0512 PWR0514 PWR0516 PWR0517 PWR0518 PWR0519 PWR0525 PWR0527 PWR0529 PWR0530 PWR0531 PWR0532 PWR0538 PWR0540 PWR0542 PWR0543 PWR0544 PWR0545 PWR0546 PWR0547 PWR0552 PWR0554 = PWR_3V3: GateName_1: G$1; SymbolName_1: PWR_3V3; LibraryName: MR26; DeviceSetName: PWR_3V3
PWR0548 PWR0562 PWR0563 PWR0566 PWR0568 PWR0570 = PWR_GNSS_VCC_RF: GateName_1: G$1; SymbolName_1: PWR_GNSS_VCC_RF; LibraryName: MR26; DeviceSetName: PWR_GNSS_VCC_RF
PWR0558 PWR0559 PWR0561 PWR0565 = PWR_GNSS_ANT_PWR: GateName_1: G$1; SymbolName_1: PWR_GNSS_ANT_PWR; LibraryName: MR26; DeviceSetName: PWR_GNSS_ANT_PWR
Q3 = PMOS_SOT23SOT-23: MPN: PMV65XP,215; GateName_1: G$1; SymbolName_1: PMOS_SOT23; DeviceName: SOT-23; LibraryName: MR26; DeviceSetName: PMOS_SOT23
Q4 = NMOS_SOT23SOT-23: MPN: 2N7002,215; GateName_1: G$1; SymbolName_1: NMOS_SOT23; DeviceName: SOT-23; LibraryName: MR26; DeviceSetName: NMOS_SOT23
R601 R603-R608 R612 = RESR_0402: MPN: RES 10k 0402; GateName_1: G$1; SymbolName_1: RES; DeviceName: R_0402; LibraryName: MR26; DeviceSetName: RES
R610 = RESR_0603: MPN: RES 10R 0.25W 0603; GateName_1: G$1; SymbolName_1: RES; DeviceName: R_0603; LibraryName: MR26; DeviceSetName: RES
R611 = RESR_0402: MPN: RES 100k 0402; GateName_1: G$1; SymbolName_1: RES; DeviceName: R_0402; LibraryName: MR26; DeviceSetName: RES
R618 R619 = RESR_0402: MPN: RES 2.2k 0402; GateName_1: G$1; SymbolName_1: RES; DeviceName: R_0402; LibraryName: MR26; DeviceSetName: RES
TP601 = TESTPOINTTP_1.0mm: MPN: Keystone 5019 / 1.0 mm pad; GateName_1: G$1; SymbolName_1: TESTPOINT; DeviceName: TP_1.0mm; LibraryName: MR26; DeviceSetName: TESTPOINT
U9 = ASM330LHHX_LGA14LGA-14L_2.5x3: MPN: ASM330LHHXTR; GateName_1: G$1; SymbolName_1: ASM330LHHX_LGA14; DeviceName: LGA-14L_2.5x3; LibraryName: MR26; DeviceSetName: ASM330LHHX_LGA14
U10-U12 = VL53L4CD_LGA12VL53L4CD_LGA12: MPN: VL53L4CDV0DH/1; GateName_1: G$1; SymbolName_1: VL53L4CD_LGA12; DeviceName: VL53L4CD_LGA12; LibraryName: MR26; DeviceSetName: VL53L4CD_LGA12
U13 = MAX-M10Su-blox_LCC-18_9.7x10.1: MPN: MAX-M10S-00B; GateName_1: G$1; SymbolName_1: MAX-M10S; DeviceName: u-blox_LCC-18_9.7x10.1; LibraryName: MR26; DeviceSetName: MAX-M10S
U19 = SN74LVC1G07_SOT23SOT-23-5: MPN: SN74LVC1G07DBVR; GateName_1: G$1; SymbolName_1: SN74LVC1G07_SOT23; DeviceName: SOT-23-5; LibraryName: MR26; DeviceSetName: SN74LVC1G07_SOT23

## Sheet MR26_GSS_7.SchDoc
size 386 x 296 mm; Origin: Eagle; OriginPath: C:\Users\David Nguyen\Downloads\eagle\eagle\MR26_GSS.sch; OriginSheet: 8; OriginDescription: 09 Interfaces: vehicle, CAN, USB-C, debug
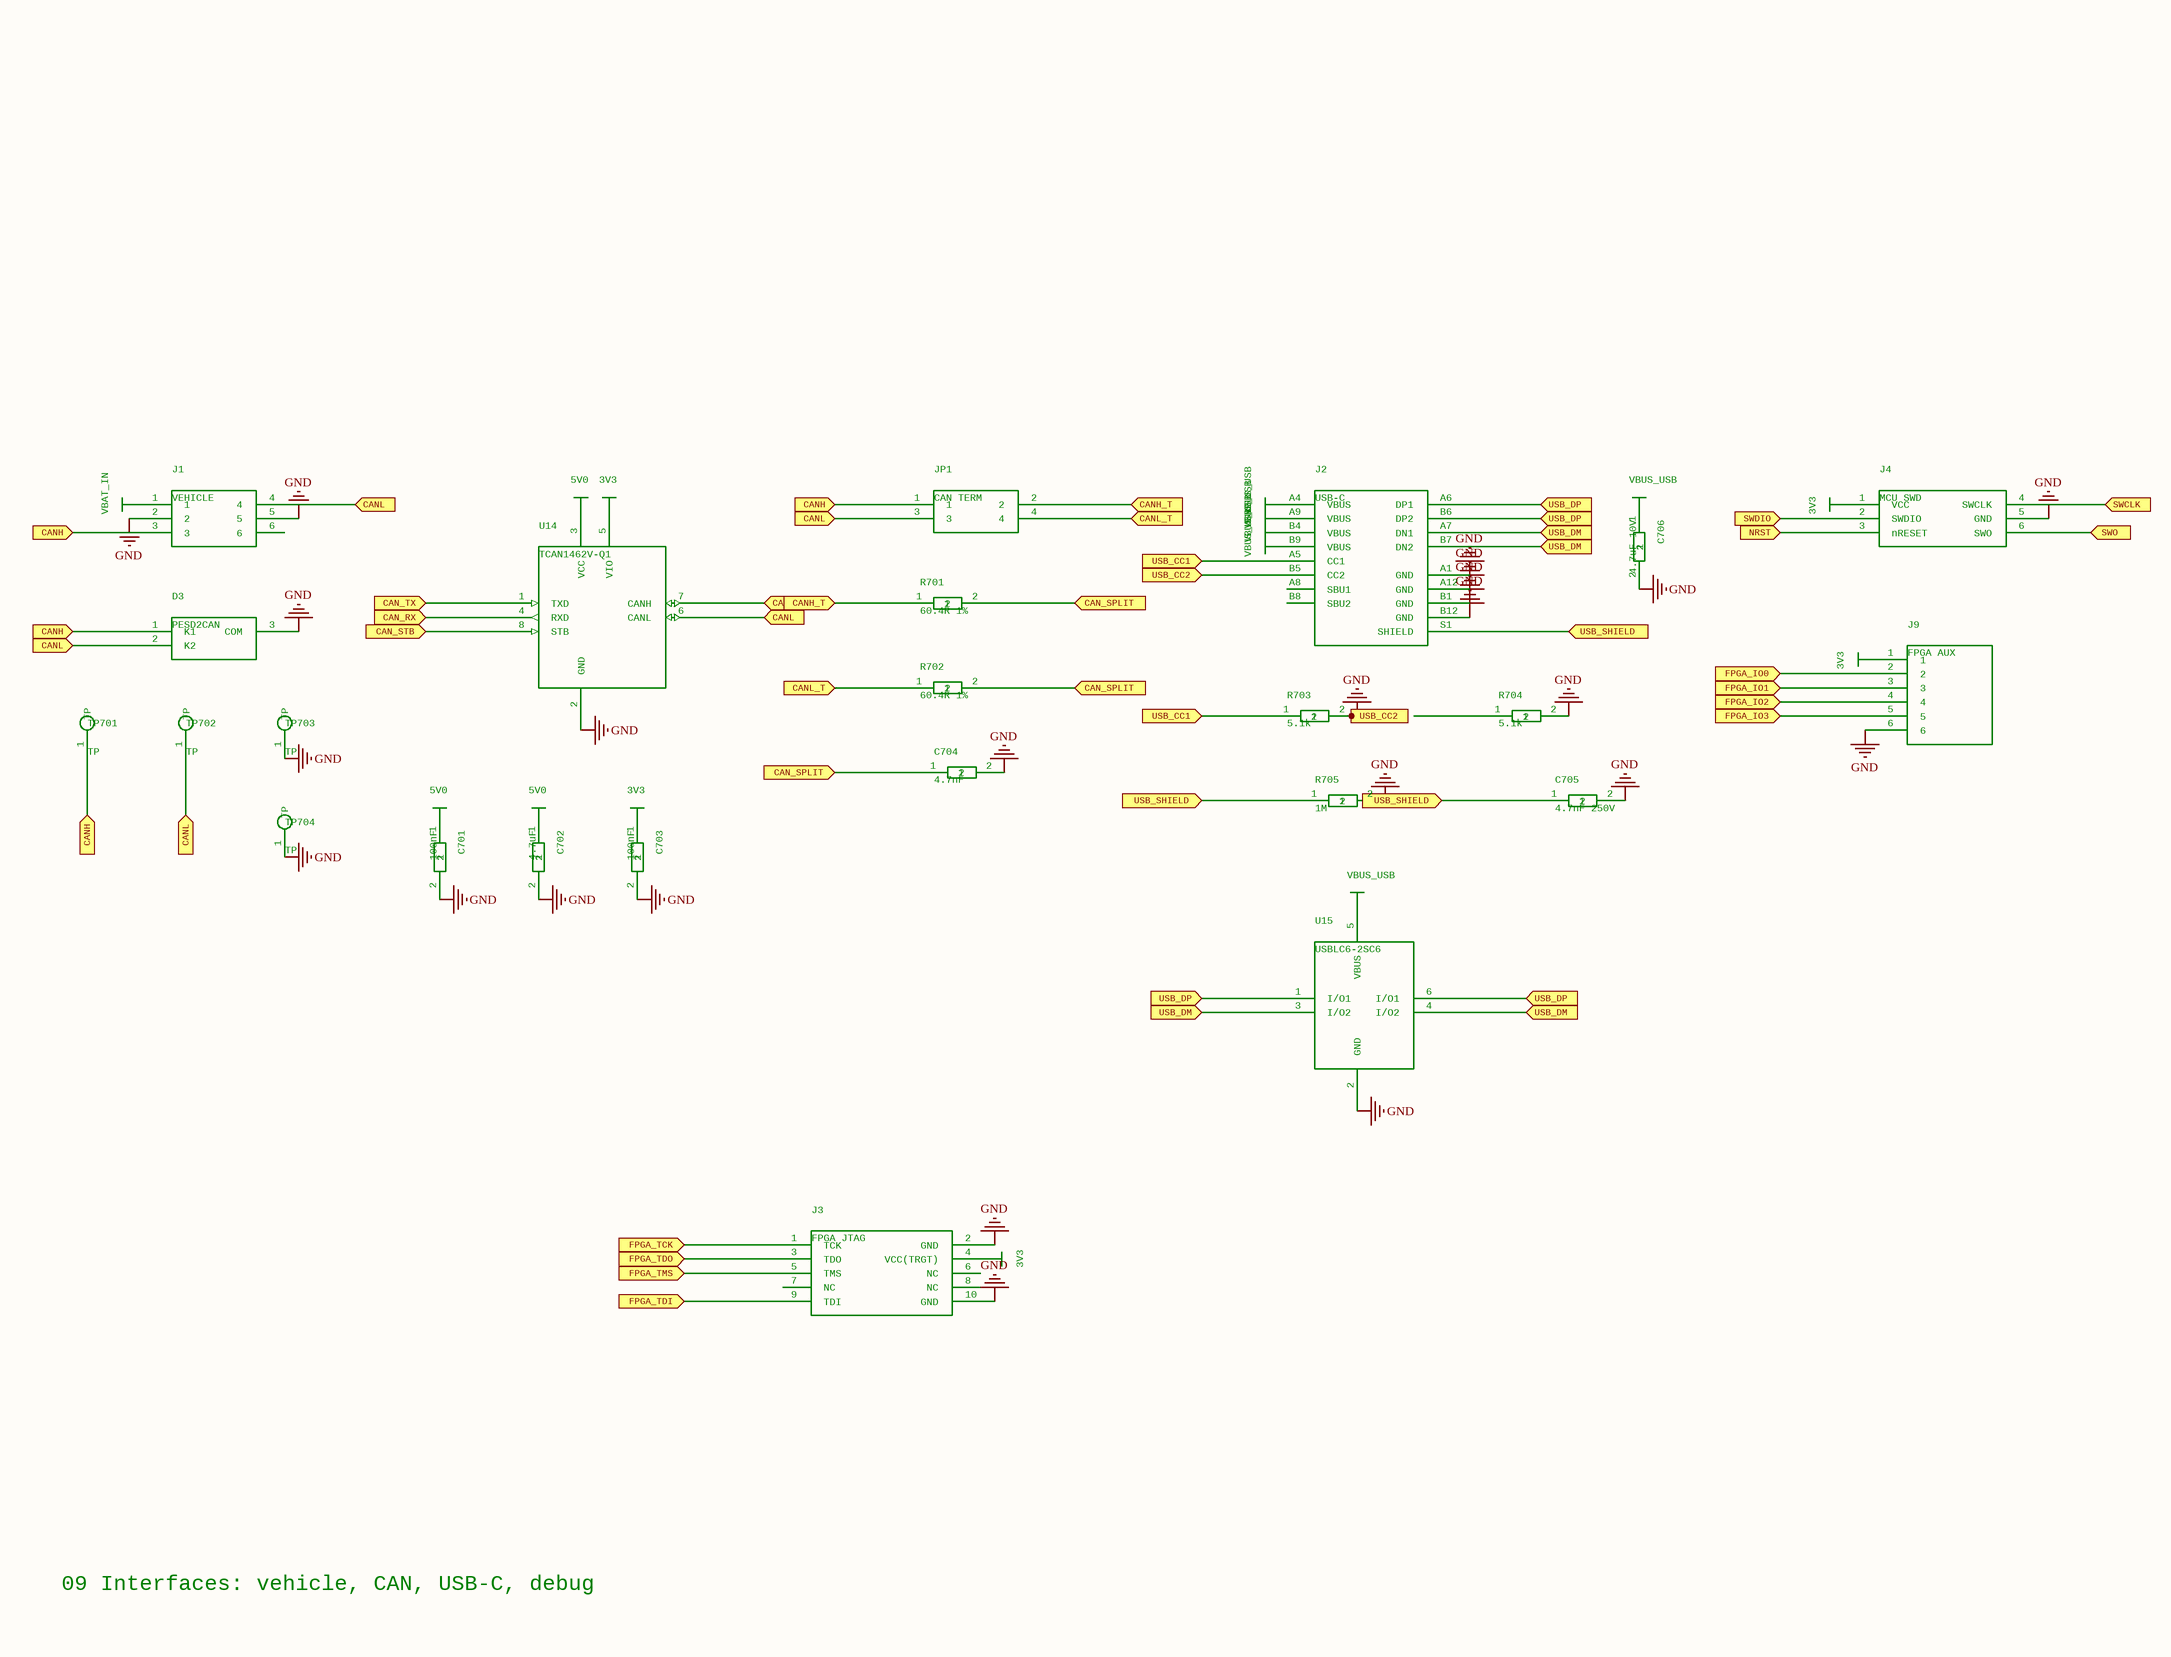
[diagram p7: MR26_GSS_7.SchDoc]

### Parts
C701  100nF  [C_0402]
C702  4.7uF  [C_0603]
C703  100nF  [C_0402]
C704  4.7nF  [C_0603]
C705  4.7nF 250V  [C_1206]
C706  4.7uF 10V  [C_0603]
D3  PESD2CAN  [SOT-23]
J1  VEHICLE  [Molex_Micro-Fit_43045-0600_2x3_RA]
J2  USB-C  [USB_C_GCT_USB4105]
J3  FPGA JTAG  [IDC-Header_2x05_P2.54mm]
J4  MCU SWD  [TC2030-IDC-NL]
J9  FPGA AUX  [PinHeader_1x06_P2.54mm]
JP1  CAN TERM  [PinHeader_2x02_P2.54mm]
PWR0571  VBAT_IN
PWR0577  5V0
PWR0578  3V3
PWR0580  5V0
PWR0582  5V0
PWR0584  3V3
PWR0587  VBUS_USB
PWR0588  VBUS_USB
PWR0589  VBUS_USB
PWR0590  VBUS_USB
PWR0599  VBUS_USB
PWR0601  VBUS_USB
PWR0604  3V3
PWR0606  3V3
PWR0608  3V3
R701  60.4R 1%  [R_0805]
R702  60.4R 1%  [R_0805]
R703  5.1k  [R_0402]
R704  5.1k  [R_0402]
R705  1M  [R_0402]
TP701  TP  [TP_1.0mm]
TP702  TP  [TP_1.0mm]
TP703  TP  [TP_1.0mm]
TP704  TP  [TP_1.0mm]
U14  TCAN1462V-Q1  [SOIC-8]
U15  USBLC6-2SC6  [SOT-23-6]

### Ports
CAN_RX (in), CAN_SPLIT (in), CAN_STB (in), CAN_TX (in), CANH (in), CANH_T (in), CANL (in), CANL_T (in), FPGA_IO0 (in), FPGA_IO1 (in), FPGA_IO2 (in), FPGA_IO3 (in), FPGA_TCK (in), FPGA_TDI (in), FPGA_TDO (in), FPGA_TMS (in), NRST (in), SWCLK (in), SWDIO (in), SWO (in), USB_CC1 (in), USB_CC2 (in), USB_DM (in), USB_DP (in), USB_SHIELD (in)

### Nets
GND: C701.2 C702.2 C703.2 C704.2 C705.2 C706.2 D3.3(COM) J1.2 J1.5 J2.A1(GND) J2.A12(GND) J2.B1(GND) J2.B5(CC2) J2.B12(GND) J3.2(GND) J3.5(TMS) J3.10(GND) J4.5(GND) J9.6 R703.2 R704.2 R705.2 TP703.1(TP) TP704.1(TP) U14.2(GND) U15.2(GND) ; port USB_CC2, port FPGA_TMS
NetC313_1: J4.3(nRESET) ; port NRST
NetC701_1: C701.1 PWR0580.?1(5V0)
NetC702_1: C702.1 PWR0582.?1(5V0)
NetC703_1: C703.1 PWR0584.?1(3V3)
NetC704_1: C704.1 R701.2 R702.2 ; port CAN_SPLIT
NetC705_1: C705.1 J2.S1(SHIELD) R705.1 ; port USB_SHIELD
NetC706_1: C706.1 PWR0599.?1(VBUS_USB)
NetD3_1: D3.1(K1) J1.3 JP1.1 TP701.1(TP) U14.7(CANH) ; port CANH
NetD3_2: D3.2(K2) J1.4 JP1.3 TP702.1(TP) U14.6(CANL) ; port CANL
NetJ1_1: J1.1 PWR0571.?1(VBAT_IN)
NetJ2_A4: J2.A4(VBUS) PWR0587.?1(VBUS_USB)
NetJ2_A5: J2.A5(CC1) R703.1 ; port USB_CC1
NetJ2_A6: J2.A6(DP1) J2.B6(DP2) U15.1(I/O1) U15.6(I/O1) ; port USB_DP
NetJ2_A7: J2.A7(DN1) J2.B7(DN2) U15.3(I/O2) U15.4(I/O2) ; port USB_DM
NetJ2_A9: J2.A9(VBUS) PWR0588.?1(VBUS_USB)
NetJ2_B4: J2.B4(VBUS) PWR0589.?1(VBUS_USB)
NetJ2_B9: J2.B9(VBUS) PWR0590.?1(VBUS_USB)
NetJ3_1: J3.1(TCK) ; port FPGA_TCK
NetJ3_3: J3.3(TDO) ; port FPGA_TDO
NetJ3_4: J3.4(VCC(TRGT)) PWR0604.?1(3V3)
NetJ3_9: J3.9(TDI) ; port FPGA_TDI
NetJ4_1: J4.1(VCC) PWR0606.?1(3V3)
NetJ4_2: J4.2(SWDIO) ; port SWDIO
NetJ4_4: J4.4(SWCLK) ; port SWCLK
NetJ4_6: J4.6(SWO) ; port SWO
NetJ9_1: J9.1 PWR0608.?1(3V3)
NetJ9_2: J9.2 ; port FPGA_IO0
NetJ9_3: J9.3 ; port FPGA_IO1
NetJ9_4: J9.4 ; port FPGA_IO2
NetJ9_5: J9.5 ; port FPGA_IO3
NetJP1_2: JP1.2 R701.1 ; port CANH_T
NetJP1_4: JP1.4 R702.1 ; port CANL_T
NetPWR0577_?1: PWR0577.?1(5V0) U14.3(VCC)
NetPWR0578_?1: PWR0578.?1(3V3) U14.5(VIO)
NetPWR0601_?1: PWR0601.?1(VBUS_USB) U15.5(VBUS)
NetU6_57: U14.8(STB) ; port CAN_STB
NetU6_58: U14.4(RXD) ; port CAN_RX
NetU6_59: U14.1(TXD) ; port CAN_TX

Not connected (* = marked no-connect by the designer): J1 6; J2 A8(SBU1) B8(SBU2); J3 6(NC) 7(NC) 8(NC); R704 1

### Notes on the sheet
- 09 Interfaces: vehicle, CAN, USB-C, debug

### Library data of the parts
C701 C703 = CAPC_0402: as C601 on sheet MR26_GSS_6; DeviceName: C_0402; LibraryName: MR26; DeviceSetName: CAP
C702 = CAPC_0603: as C605 on sheet MR26_GSS_6; DeviceName: C_0603; LibraryName: MR26; DeviceSetName: CAP
C704 = CAPC_0603: MPN: CAP 4.7nF 0603; GateName_1: G$1; SymbolName_1: CAP; DeviceName: C_0603; LibraryName: MR26; DeviceSetName: CAP
C705 = CAPC_1206: MPN: CAP 4.7nF 250V 1206; GateName_1: G$1; SymbolName_1: CAP; DeviceName: C_1206; LibraryName: MR26; DeviceSetName: CAP
C706 = CAPC_0603: MPN: CAP 4.7uF 10V 0603; GateName_1: G$1; SymbolName_1: CAP; DeviceName: C_0603; LibraryName: MR26; DeviceSetName: CAP
D3 = PESD2CAN_SOT23SOT-23: MPN: PESD2CAN,215; GateName_1: G$1; SymbolName_1: PESD2CAN_SOT23; DeviceName: SOT-23; LibraryName: MR26; DeviceSetName: PESD2CAN_SOT23
J1 = MICROFIT_2X3Molex_Micro-Fit_43045-0600_2x3_RA: MPN: Molex 43045-0600; GateName_1: G$1; SymbolName_1: MICROFIT_2X3; DeviceName: Molex_Micro-Fit_43045-0600_2x3_RA; LibraryName: MR26; DeviceSetName: MICROFIT_2X3
J2 = USB4105_USBCUSB_C_GCT_USB4105: MPN: GCT USB4105-GF-A; GateName_1: G$1; SymbolName_1: USB4105_USBC; DeviceName: USB_C_GCT_USB4105; LibraryName: MR26; DeviceSetName: USB4105_USBC
J3 = HDR_2X5_JTAGIDC-Header_2x05_P2.54mm: MPN: Wurth 61201021621; GateName_1: G$1; SymbolName_1: HDR_2X5_JTAG; DeviceName: IDC-Header_2x05_P2.54mm; LibraryName: MR26; DeviceSetName: HDR_2X5_JTAG
J4 = TC2030_IDC_NLTC2030-IDC-NL: MPN: Tag-Connect TC2030-IDC-NL (footprint only); GateName_1: G$1; SymbolName_1: TC2030_IDC_NL; DeviceName: TC2030-IDC-NL; LibraryName: MR26; DeviceSetName: TC2030_IDC_NL
J9 = HDR_1X6PinHeader_1x06_P2.54mm: MPN: Wurth 61300611121; GateName_1: G$1; SymbolName_1: HDR_1X6; DeviceName: PinHeader_1x06_P2.54mm; LibraryName: MR26; DeviceSetName: HDR_1X6
JP1 = HDR_2X2PinHeader_2x02_P2.54mm: MPN: Wurth 61300421121 + 2 shunts; GateName_1: G$1; SymbolName_1: HDR_2X2; DeviceName: PinHeader_2x02_P2.54mm; LibraryName: MR26; DeviceSetName: HDR_2X2
PWR0571 = PWR_VBAT_IN: GateName_1: G$1; SymbolName_1: PWR_VBAT_IN; LibraryName: MR26; DeviceSetName: PWR_VBAT_IN
PWR0577 PWR0580 PWR0582 = PWR_5V0: GateName_1: G$1; SymbolName_1: PWR_5V0; LibraryName: MR26; DeviceSetName: PWR_5V0
PWR0578 PWR0584 PWR0604 PWR0606 PWR0608 = PWR_3V3: GateName_1: G$1; SymbolName_1: PWR_3V3; LibraryName: MR26; DeviceSetName: PWR_3V3
PWR0587 PWR0588 PWR0589 PWR0590 PWR0599 PWR0601 = PWR_VBUS_USB: GateName_1: G$1; SymbolName_1: PWR_VBUS_USB; LibraryName: MR26; DeviceSetName: PWR_VBUS_USB
R701 R702 = RESR_0805: MPN: RES 60.4R 1% 0805; GateName_1: G$1; SymbolName_1: RES; DeviceName: R_0805; LibraryName: MR26; DeviceSetName: RES
R703 R704 = RESR_0402: MPN: RES 5.1k 0402; GateName_1: G$1; SymbolName_1: RES; DeviceName: R_0402; LibraryName: MR26; DeviceSetName: RES
R705 = RESR_0402: MPN: RES 1M 0402; GateName_1: G$1; SymbolName_1: RES; DeviceName: R_0402; LibraryName: MR26; DeviceSetName: RES
TP701-TP704 = TESTPOINTTP_1.0mm: as TP601 on sheet MR26_GSS_6; SymbolName_1: TESTPOINT; DeviceName: TP_1.0mm; LibraryName: MR26; DeviceSetName: TESTPOINT
U14 = TCAN1462V_SOIC8SOIC-8: MPN: TCAN1462VDRQ1; GateName_1: G$1; SymbolName_1: TCAN1462V_SOIC8; DeviceName: SOIC-8; LibraryName: MR26; DeviceSetName: TCAN1462V_SOIC8
U15 = USBLC6-2SC6SOT-23-6: GateName_1: G$1; SymbolName_1: USBLC6-2SC6; DeviceName: SOT-23-6; LibraryName: MR26; DeviceSetName: USBLC6-2SC6; MPN: USBLC6-2SC6

## Sheet MR26_GSS_8.SchDoc
size 383 x 296 mm; Origin: Eagle; OriginPath: C:\Users\David Nguyen\Downloads\eagle\eagle\MR26_GSS.sch; OriginSheet: 9; OriginDescription: 10 FPGA unused banks, GND & NC
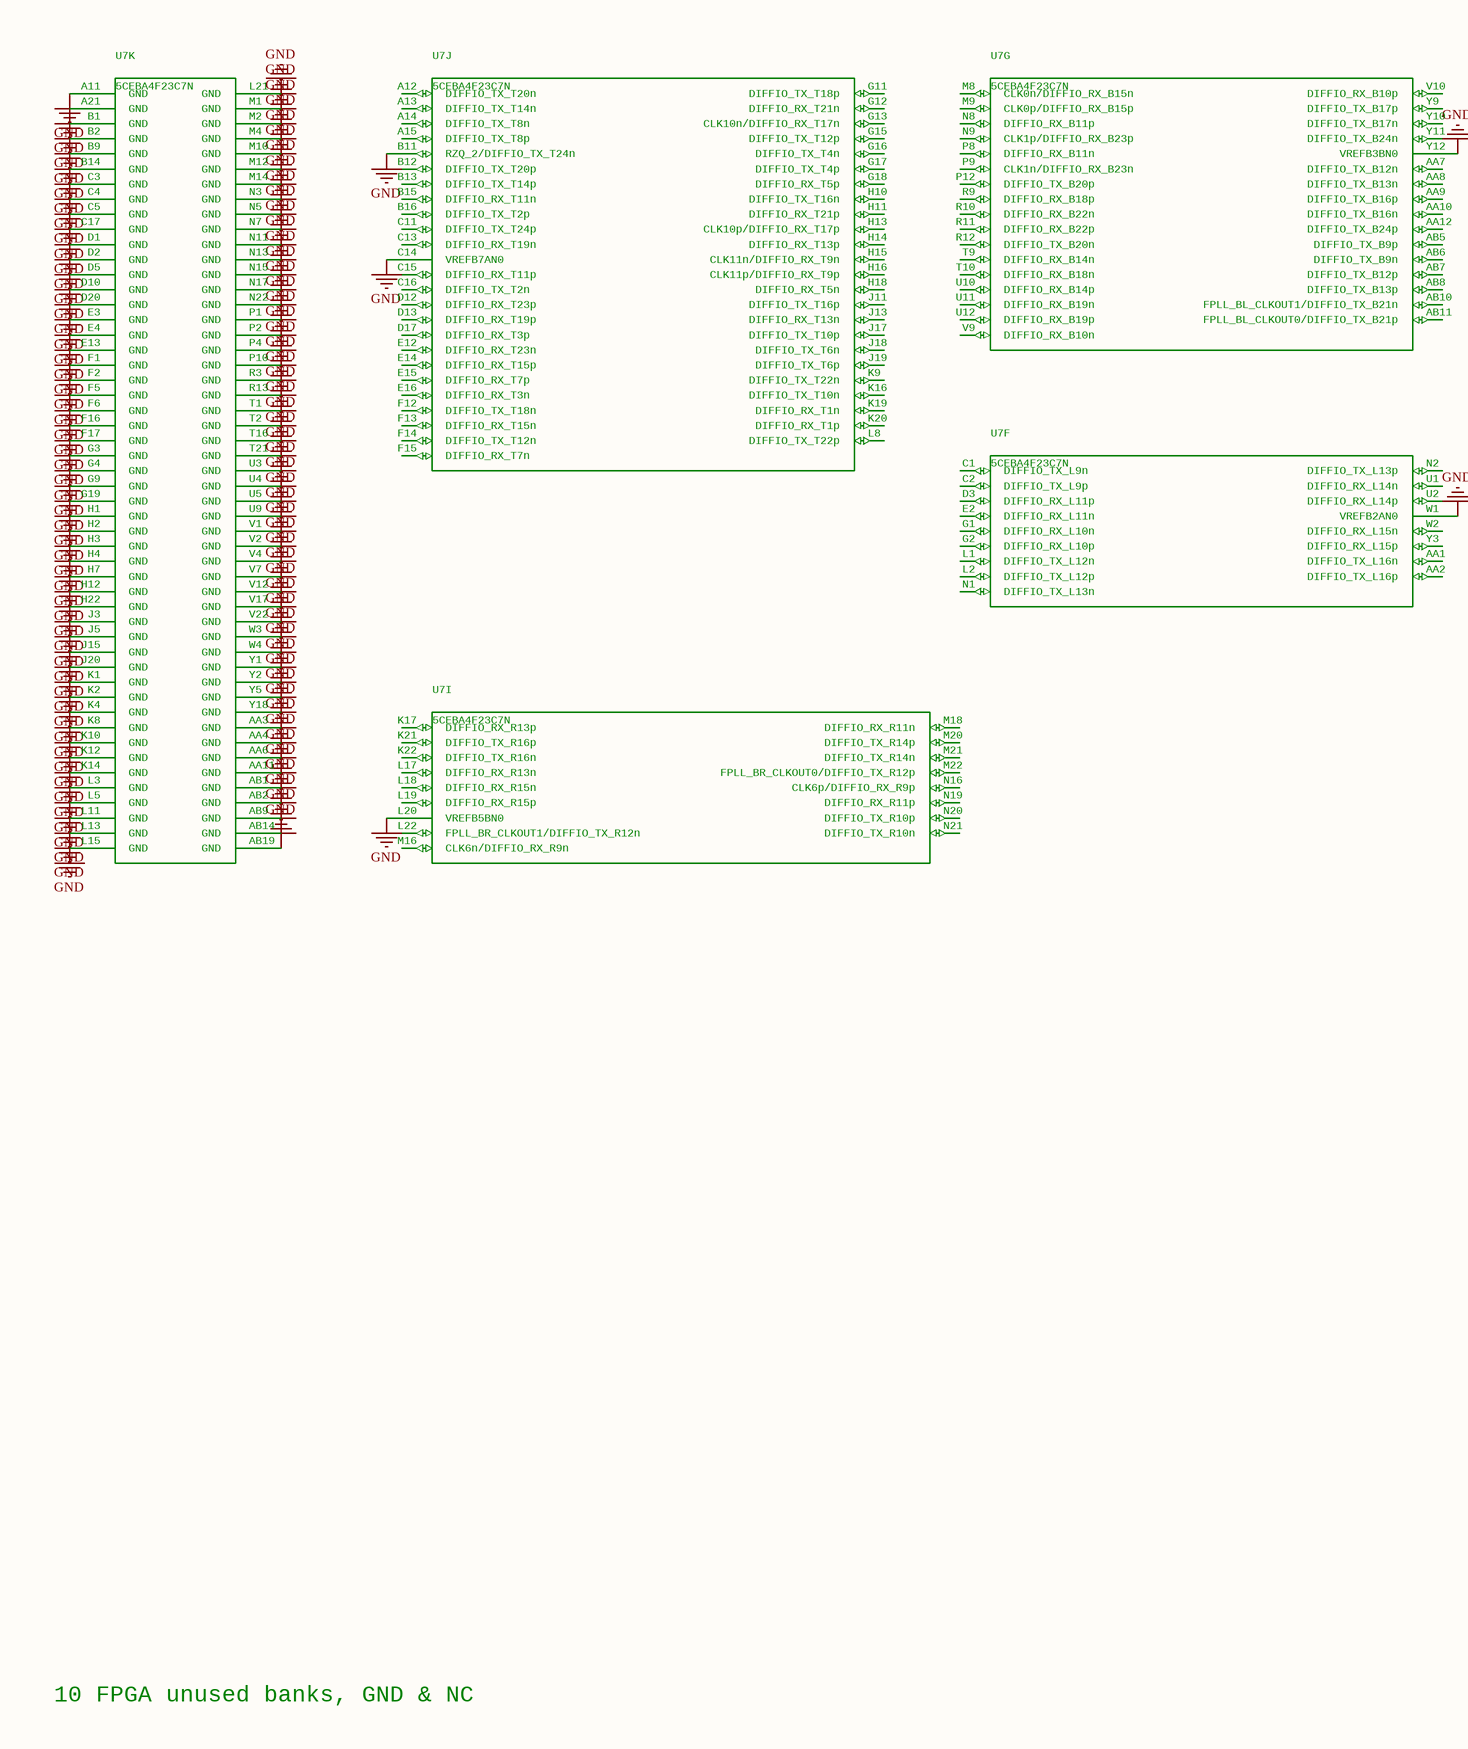
[diagram p8: MR26_GSS_8.SchDoc, left]
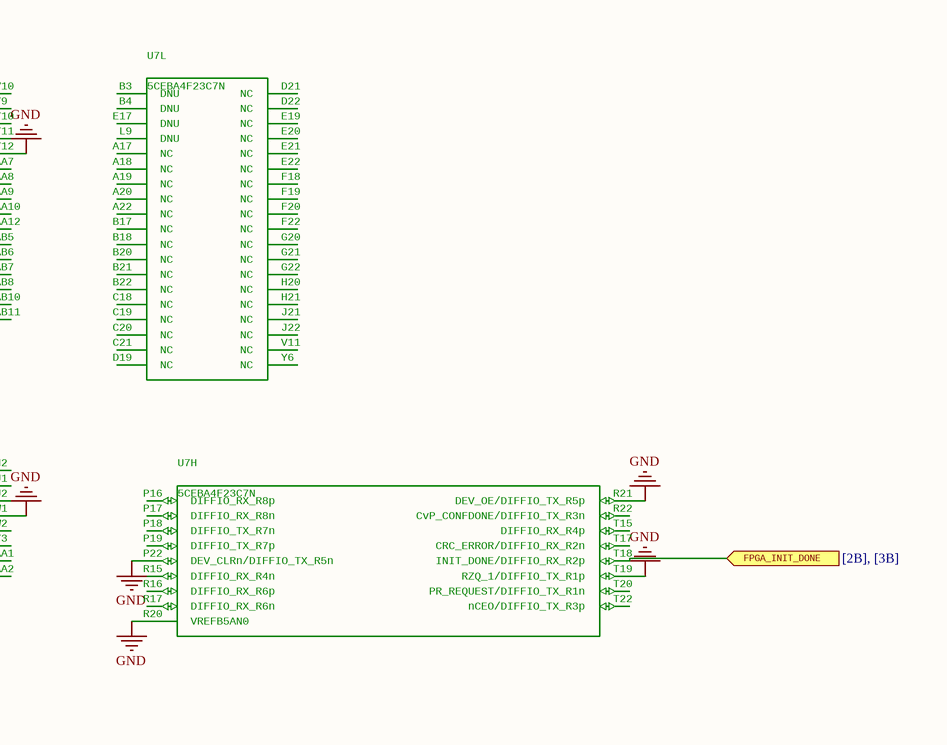
[diagram p9: MR26_GSS_8.SchDoc, right]

### Parts
U7  5CEBA4F23C7N  [FBGA-484_23x23_1.0mm]  (parts F,G,H,I,J,K,L of 12)

### Ports
FPGA_INIT_DONE (in, see [2B], [3B])

### Nets
GND: U7.A11(GND) U7.A21(GND) U7.AA3(GND) U7.AA4(GND) U7.AA6(GND) U7.AA11(GND) U7.AB1(GND) U7.AB2(GND) U7.AB9(GND) U7.AB14(GND) U7.AB19(GND) U7.B1(GND) U7.B2(GND) U7.B9(GND) U7.B11(RZQ_2/DIFFIO_TX_T24n) U7.B14(GND) U7.C3(GND) U7.C4(GND) U7.C5(GND) U7.C14(VREFB7AN0) U7.C17(GND) U7.D1(GND) U7.D2(GND) U7.D5(GND) U7.D10(GND) U7.D20(GND) U7.E3(GND) U7.E4(GND) U7.E13(GND) U7.F1(GND) U7.F2(GND) U7.F5(GND) U7.F6(GND) U7.F16(GND) U7.F17(GND) U7.G3(GND) U7.G4(GND) U7.G9(GND) U7.G19(GND) U7.H1(GND) U7.H2(GND) U7.H3(GND) U7.H4(GND) U7.H7(GND) U7.H12(GND) U7.H22(GND) U7.J3(GND) U7.J5(GND) U7.J15(GND) U7.J20(GND) U7.K1(GND) U7.K2(GND) U7.K4(GND) U7.K8(GND) U7.K10(GND) U7.K12(GND) U7.K14(GND) U7.L3(GND) U7.L5(GND) U7.L11(GND) U7.L13(GND) U7.L15(GND) U7.L20(VREFB5BN0) U7.L21(GND) U7.M1(GND) U7.M2(GND) U7.M4(GND) U7.M10(GND) U7.M12(GND) U7.M14(GND) U7.N3(GND) U7.N5(GND) U7.N7(GND) U7.N11(GND) U7.N13(GND) U7.N15(GND) U7.N17(GND) U7.N22(GND) U7.P1(GND) U7.P2(GND) U7.P4(GND) U7.P10(GND) U7.P22(DEV_CLRn/DIFFIO_TX_R5n) U7.R3(GND) U7.R13(GND) U7.R20(VREFB5AN0) U7.R21(DEV_OE/DIFFIO_TX_R5p) U7.T1(GND) U7.T2(GND) U7.T16(GND) U7.T19(RZQ_1/DIFFIO_TX_R1p) U7.T21(GND) U7.U3(GND) U7.U4(GND) U7.U5(GND) U7.U9(GND) U7.V1(GND) U7.V2(GND) U7.V4(GND) U7.V7(GND) U7.V12(GND) U7.V17(GND) U7.V22(GND) U7.W1(VREFB2AN0) U7.W3(GND) U7.W4(GND) U7.Y1(GND) U7.Y2(GND) U7.Y5(GND) U7.Y12(VREFB3BN0) U7.Y18(GND)
NetR414_1: U7.T18(INIT_DONE/DIFFIO_RX_R2p) ; port FPGA_INIT_DONE

Not connected (* = marked no-connect by the designer): U7 A12(DIFFIO_TX_T20n) A13(DIFFIO_TX_T14n) A14(DIFFIO_TX_T8n) A15(DIFFIO_TX_T8p) A17(NC) A18(NC) A19(NC) A20(NC) A22(NC) AA1(DIFFIO_TX_L16n) AA2(DIFFIO_TX_L16p) AA7(DIFFIO_TX_B12n) AA8(DIFFIO_TX_B13n) AA9(DIFFIO_TX_B16p) AA10(DIFFIO_TX_B16n) AA12(DIFFIO_TX_B24p) AB5(DIFFIO_TX_B9p) AB6(DIFFIO_TX_B9n) AB7(DIFFIO_TX_B12p) AB8(DIFFIO_TX_B13p) AB10(FPLL_BL_CLKOUT1/DIFFIO_TX_B21n) AB11(FPLL_BL_CLKOUT0/DIFFIO_TX_B21p) B3(DNU) B4(DNU) B12(DIFFIO_TX_T20p) B13(DIFFIO_TX_T14p) B15(DIFFIO_RX_T11n) B16(DIFFIO_TX_T2p) B17(NC) B18(NC) B20(NC) B21(NC) B22(NC) C1(DIFFIO_TX_L9n) C2(DIFFIO_TX_L9p) C11(DIFFIO_TX_T24p) C13(DIFFIO_RX_T19n) C15(DIFFIO_RX_T11p) C16(DIFFIO_TX_T2n) C18(NC) C19(NC) C20(NC) C21(NC) D3(DIFFIO_RX_L11p) D12(DIFFIO_RX_T23p) D13(DIFFIO_RX_T19p) D17(DIFFIO_RX_T3p) D19(NC) D21(NC) D22(NC) E2(DIFFIO_RX_L11n) E12(DIFFIO_RX_T23n) E14(DIFFIO_RX_T15p) E15(DIFFIO_RX_T7p) E16(DIFFIO_RX_T3n) E17(DNU) E19(NC) E20(NC) E21(NC) E22(NC) F12(DIFFIO_TX_T18n) F13(DIFFIO_RX_T15n) F14(DIFFIO_TX_T12n) F15(DIFFIO_RX_T7n) F18(NC) F19(NC) F20(NC) F22(NC) G1(DIFFIO_RX_L10n) G2(DIFFIO_RX_L10p) G11(DIFFIO_TX_T18p) G12(DIFFIO_RX_T21n) G13(CLK10n/DIFFIO_RX_T17n) G15(DIFFIO_TX_T12p) G16(DIFFIO_TX_T4n) G17(DIFFIO_TX_T4p) G18(DIFFIO_RX_T5p) G20(NC) G21(NC) G22(NC) H10(DIFFIO_TX_T16n) H11(DIFFIO_RX_T21p) H13(CLK10p/DIFFIO_RX_T17p) H14(DIFFIO_RX_T13p) H15(CLK11n/DIFFIO_RX_T9n) H16(CLK11p/DIFFIO_RX_T9p) H18(DIFFIO_RX_T5n) H20(NC) H21(NC) J11(DIFFIO_TX_T16p) J13(DIFFIO_RX_T13n) J17(DIFFIO_TX_T10p) J18(DIFFIO_TX_T6n) J19(DIFFIO_TX_T6p) J21(NC) J22(NC) K9(DIFFIO_TX_T22n) K16(DIFFIO_TX_T10n) K17(DIFFIO_RX_R13p) K19(DIFFIO_RX_T1n) K20(DIFFIO_RX_T1p) K21(DIFFIO_TX_R16p) K22(DIFFIO_TX_R16n) L1(DIFFIO_TX_L12n) L2(DIFFIO_TX_L12p) L8(DIFFIO_TX_T22p) L9(DNU) L17(DIFFIO_RX_R13n) L18(DIFFIO_RX_R15n) L19(DIFFIO_RX_R15p) L22(FPLL_BR_CLKOUT1/DIFFIO_TX_R12n) M8(CLK0n/DIFFIO_RX_B15n) M9(CLK0p/DIFFIO_RX_B15p) M16(CLK6n/DIFFIO_RX_R9n) M18(DIFFIO_RX_R11n) M20(DIFFIO_TX_R14p) M21(DIFFIO_TX_R14n) M22(FPLL_BR_CLKOUT0/DIFFIO_TX_R12p) N1(DIFFIO_TX_L13n) N2(DIFFIO_TX_L13p) N8(DIFFIO_RX_B11p) N9(CLK1p/DIFFIO_RX_B23p) N16(CLK6p/DIFFIO_RX_R9p) N19(DIFFIO_RX_R11p) N20(DIFFIO_TX_R10p) N21(DIFFIO_TX_R10n) P8(DIFFIO_RX_B11n) P9(CLK1n/DIFFIO_RX_B23n) P12(DIFFIO_TX_B20p) P16(DIFFIO_RX_R8p) P17(DIFFIO_RX_R8n) P18(DIFFIO_TX_R7n) P19(DIFFIO_TX_R7p) R9(DIFFIO_RX_B18p) R10(DIFFIO_RX_B22n) R11(DIFFIO_RX_B22p) R12(DIFFIO_TX_B20n) R15(DIFFIO_RX_R4n) R16(DIFFIO_RX_R6p) R17(DIFFIO_RX_R6n) R22(CvP_CONFDONE/DIFFIO_TX_R3n) T9(DIFFIO_RX_B14n) T10(DIFFIO_RX_B18n) T15(DIFFIO_RX_R4p) T17(CRC_ERROR/DIFFIO_RX_R2n) T20(PR_REQUEST/DIFFIO_TX_R1n) T22(nCEO/DIFFIO_TX_R3p) U1(DIFFIO_RX_L14n) U2(DIFFIO_RX_L14p) U10(DIFFIO_RX_B14p) U11(DIFFIO_RX_B19n) U12(DIFFIO_RX_B19p) V9(DIFFIO_RX_B10n) V10(DIFFIO_RX_B10p) V11(NC) W2(DIFFIO_RX_L15n) Y3(DIFFIO_RX_L15p) Y6(NC) Y9(DIFFIO_TX_B17p) Y10(DIFFIO_TX_B17n) Y11(DIFFIO_TX_B24n)

### Notes on the sheet
- 10 FPGA unused banks, GND & NC

### Library data of the parts
U7 = 5CEBA4F23C7NFBGA-484_23x23_1.0mm: GateName_1: A; SymbolName_1: 5CEBA4F23C7N_A; GateName_2: B; SymbolName_2: 5CEBA4F23C7N_B; GateName_3: C; SymbolName_3: 5CEBA4F23C7N_C; GateName_4: D; SymbolName_4: 5CEBA4F23C7N_D; GateName_5: E; SymbolName_5: 5CEBA4F23C7N_E; GateName_6: F; SymbolName_6: 5CEBA4F23C7N_F; GateName_7: G; SymbolName_7: 5CEBA4F23C7N_G; GateName_8: H; SymbolName_8: 5CEBA4F23C7N_H; GateName_9: I; SymbolName_9: 5CEBA4F23C7N_I; GateName_10: J; SymbolName_10: 5CEBA4F23C7N_J; GateName_11: K; SymbolName_11: 5CEBA4F23C7N_K; GateName_12: L; SymbolName_12: 5CEBA4F23C7N_L; DeviceName: FBGA-484_23x23_1.0mm; LibraryName: MR26; DeviceSetName: 5CEBA4F23C7N; MPN: 5CEBA4F23C7N

## Nets that join several sheets
GND: MR26_GSS_0 (24 pins), MR26_GSS_1 (34 pins), MR26_GSS_2 (29 pins), MR26_GSS_3 (62 pins), MR26_GSS_4 (18 pins), MR26_GSS_5 (42 pins), MR26_GSS_6 (39 pins), MR26_GSS_7 (26 pins), MR26_GSS_8 (111 pins)
NetC313_1: MR26_GSS_2 (C313.1 U6.7), MR26_GSS_7 (J4.3)
NetJ2_A6: MR26_GSS_2 (U6.46), MR26_GSS_7 (J2.A6 J2.B6 U15.1 U15.6)
NetJ2_A7: MR26_GSS_2 (U6.45), MR26_GSS_7 (J2.A7 J2.B7 U15.3 U15.4)
NetJ3_1: MR26_GSS_4 (R415.1 U7.V5), MR26_GSS_7 (J3.1)
NetJ3_3: MR26_GSS_4 (U7.M5), MR26_GSS_7 (J3.3)
NetJ3_9: MR26_GSS_4 (R417.1 U7.W5), MR26_GSS_7 (J3.9)
NetJ4_2: MR26_GSS_2 (U6.49), MR26_GSS_7 (J4.2)
NetJ4_4: MR26_GSS_2 (U6.50), MR26_GSS_7 (J4.4)
NetJ4_6: MR26_GSS_2 (U6.56), MR26_GSS_7 (J4.6)
NetJ5_17: MR26_GSS_2 (U6.33), MR26_GSS_5 (J5.17 R522.1)
NetJ5_20: MR26_GSS_2 (U6.40), MR26_GSS_5 (J5.20 R520.1)
NetJ5_21: MR26_GSS_2 (U6.41), MR26_GSS_5 (J5.21 R521.1)
NetJ9_2: MR26_GSS_5 (U7.Y21), MR26_GSS_7 (J9.2)
NetJ9_3: MR26_GSS_5 (U7.W21), MR26_GSS_7 (J9.3)
NetJ9_4: MR26_GSS_5 (U7.V21), MR26_GSS_7 (J9.4)
NetJ9_5: MR26_GSS_5 (U7.U21), MR26_GSS_7 (J9.5)
NetPWR0428_?1: MR26_GSS_3 (U7.A1), MR26_GSS_4 (PWR0428.?1 R417.2)
NetQ5_1: MR26_GSS_2 (U6.43), MR26_GSS_4 (Q5.1 R413.1 U7.K6)
NetR207_1: MR26_GSS_0 (R207.1 TP209.1 U2.19), MR26_GSS_1 (U5.2)
NetR218_1: MR26_GSS_1 (R218.1 U3.11), MR26_GSS_2 (U6.53)
NetR305_1: MR26_GSS_2 (R305.1 U6.13), MR26_GSS_5 (U7.AB20)
NetR306_1: MR26_GSS_2 (R306.1 U6.62), MR26_GSS_5 (U18.4)
NetR411_1: MR26_GSS_2 (U6.42), MR26_GSS_4 (R411.1 U7.A4)
NetR412_1: MR26_GSS_2 (U6.52), MR26_GSS_4 (R412.1 U7.H5)
NetR414_1: MR26_GSS_2 (U6.44), MR26_GSS_4 (R414.1), MR26_GSS_8 (U7.T18)
NetR420_2: MR26_GSS_4 (R420.2), MR26_GSS_5 (U7.W16)
NetR601_1: MR26_GSS_2 (U6.18), MR26_GSS_6 (R601.1 U9.12)
NetR603_1: MR26_GSS_2 (U6.8), MR26_GSS_6 (R603.1 U10.5)
NetR604_1: MR26_GSS_2 (U6.24), MR26_GSS_6 (R604.1 U10.7)
NetR605_1: MR26_GSS_2 (U6.9), MR26_GSS_6 (R605.1 U11.5)
NetR606_1: MR26_GSS_2 (U6.25), MR26_GSS_6 (R606.1 U11.7)
NetR607_1: MR26_GSS_2 (U6.10 U6.51), MR26_GSS_6 (6 pins)
NetR608_1: MR26_GSS_2 (U6.26), MR26_GSS_6 (R608.1 U12.7)
NetR619_1: MR26_GSS_2 (U6.60), MR26_GSS_6 (R619.1 U10.9 U11.9 U12.9)
NetU6_12: MR26_GSS_2 (U6.12), MR26_GSS_5 (U7.AA20), MR26_GSS_6 (U13.4)
NetU6_14: MR26_GSS_2 (U6.14), MR26_GSS_6 (U13.3)
NetU6_17: MR26_GSS_2 (U6.17), MR26_GSS_6 (U13.2)
NetU6_19: MR26_GSS_2 (U6.19), MR26_GSS_6 (U9.13)
NetU6_20: MR26_GSS_2 (U6.20), MR26_GSS_6 (U9.1)
NetU6_21: MR26_GSS_2 (U6.21), MR26_GSS_6 (U9.14)
NetU6_22: MR26_GSS_2 (U6.22), MR26_GSS_6 (U9.4)
NetU6_23: MR26_GSS_2 (U6.23), MR26_GSS_5 (U7.AA19), MR26_GSS_6 (U9.9)
NetU6_30: MR26_GSS_2 (U6.30), MR26_GSS_6 (U13.9)
NetU6_34: MR26_GSS_2 (U6.34), MR26_GSS_5 (U7.AA18)
NetU6_35: MR26_GSS_2 (U6.35), MR26_GSS_5 (U7.AB17)
NetU6_36: MR26_GSS_2 (U6.36), MR26_GSS_5 (U7.AA17)
NetU6_37: MR26_GSS_2 (U6.37), MR26_GSS_5 (U7.AB18)
NetU6_39: MR26_GSS_2 (U6.39), MR26_GSS_5 (U7.AB21)
NetU6_57: MR26_GSS_2 (U6.57), MR26_GSS_7 (U14.8)
NetU6_58: MR26_GSS_2 (U6.58), MR26_GSS_7 (U14.4)
NetU6_59: MR26_GSS_2 (U6.59), MR26_GSS_7 (U14.1)